# EAGLE design flippie (EAGLE 7.7.0)
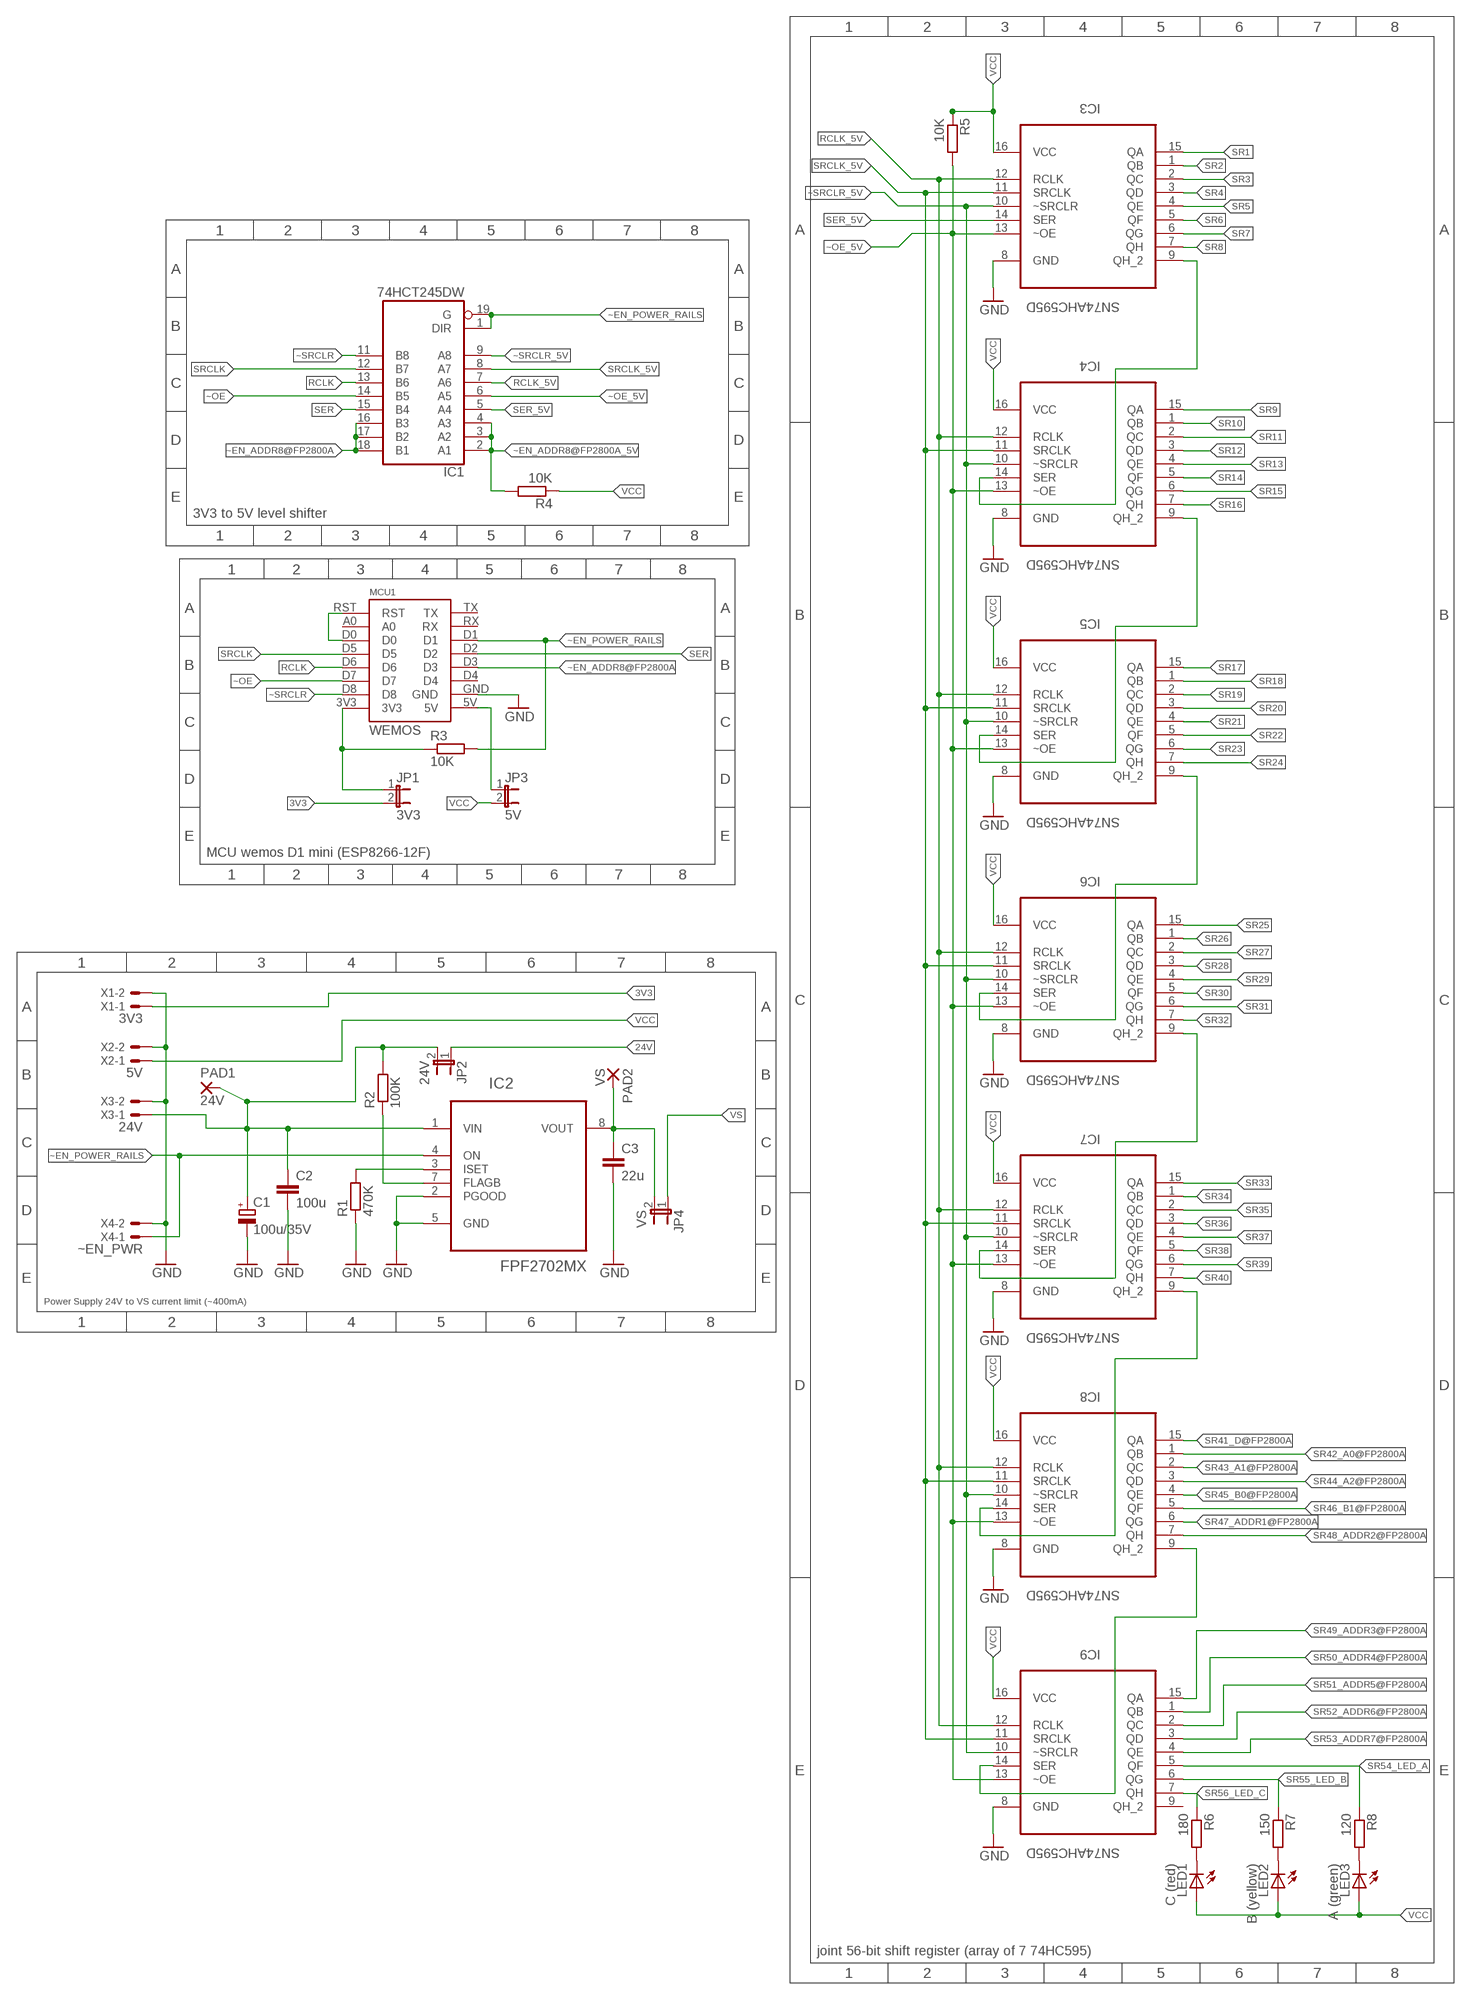
[diagram p0: schematic, sheet 1, part 1 of 2]
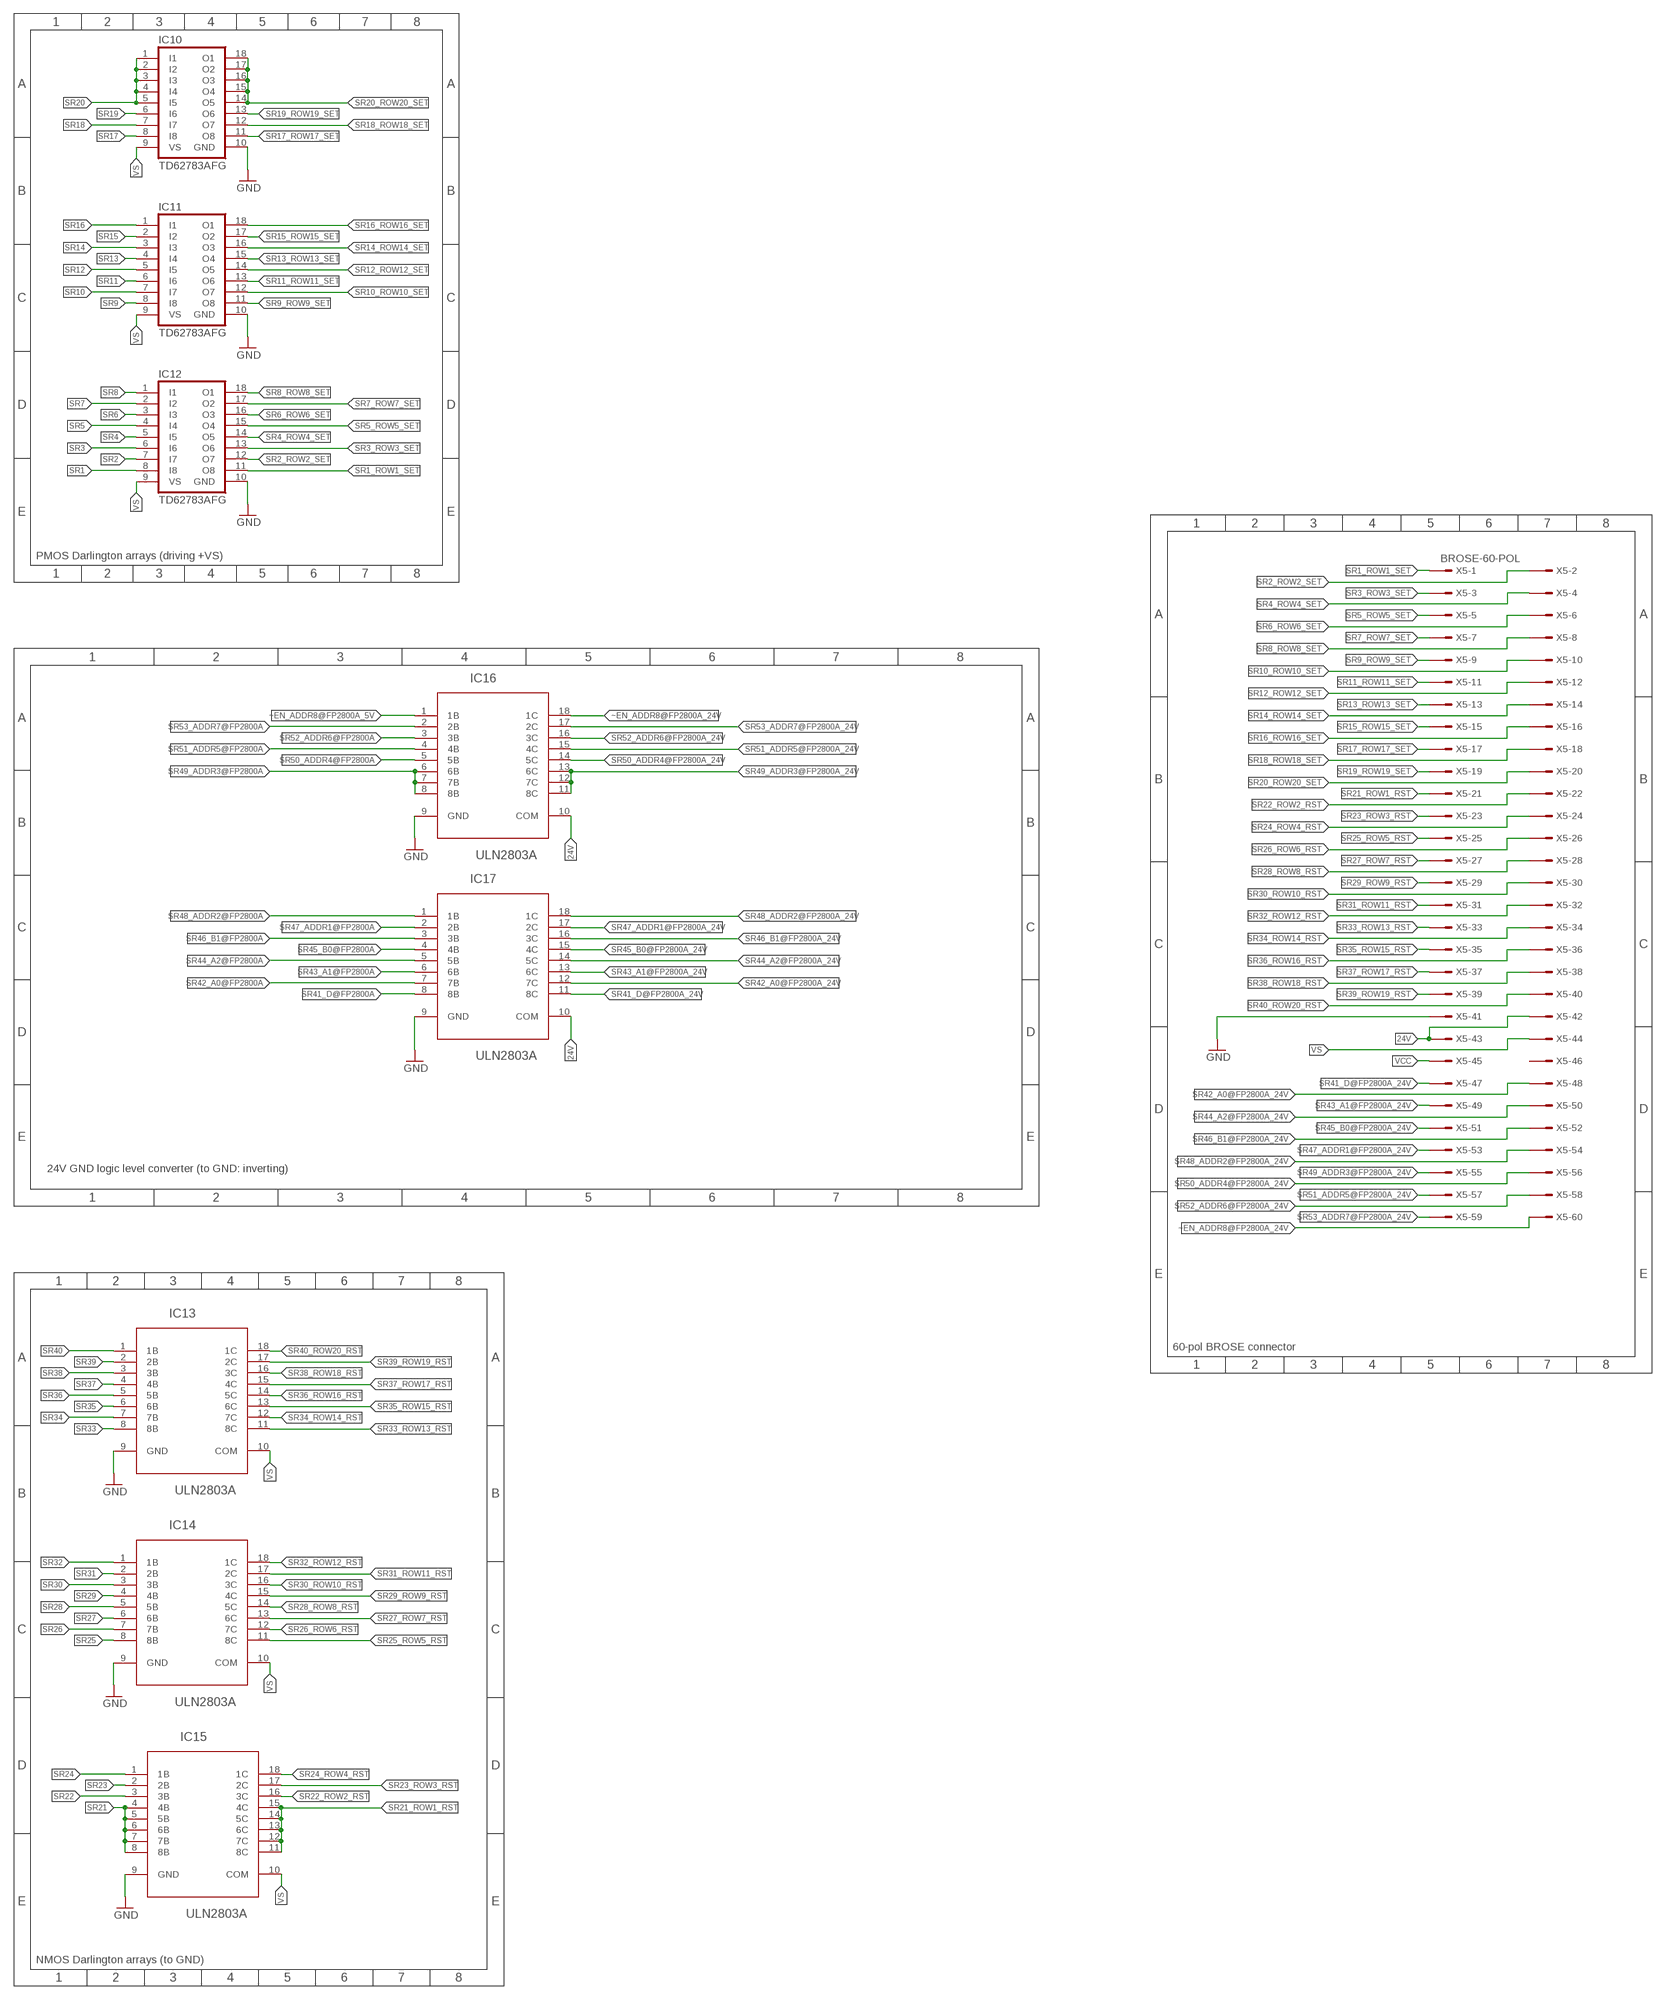
[diagram p1: schematic, sheet 1, part 2 of 2]

## Parts
C1  100u/35V  CPOL-EUE  [PANASONIC_E]
C2  100u  C-EUC1206  [C1206]
C3  22u  C-EUC1206  [C1206]
IC1  74HCT245DW  [SO20W]
IC2  FPF2702MX  FPF2700  [SOIC127P600X175-8N]
IC3  SN74AHC595D  [SOIC127P600X175-16N]
IC4  SN74AHC595D  [SOIC127P600X175-16N]
IC5  SN74AHC595D  [SOIC127P600X175-16N]
IC6  SN74AHC595D  [SOIC127P600X175-16N]
IC7  SN74AHC595D  [SOIC127P600X175-16N]
IC8  SN74AHC595D  [SOIC127P600X175-16N]
IC9  SN74AHC595D  [SOIC127P600X175-16N]
IC10  TD62783AFG  UDN2981LW  [SO18W]
IC11  TD62783AFG  UDN2981LW  [SO18W]
IC12  TD62783AFG  UDN2981LW  [SO18W]
IC13  ULN2803A  ULN2803ADW  [SOIC127P1030X265-18N]
IC14  ULN2803A  ULN2803ADW  [SOIC127P1030X265-18N]
IC15  ULN2803A  ULN2803ADW  [SOIC127P1030X265-18N]
IC16  ULN2803A  ULN2803ADW  [SOIC127P1030X265-18N]
IC17  ULN2803A  ULN2803ADW  [SOIC127P1030X265-18N]
JP1  3V3  JP1E  [JP1]
JP2  24V  JP1E  [JP1]
JP3  5V  JP1E  [JP1]
JP4  VS  JP1E  [JP1]
LED1  C (red)  LEDSMT1206  [1206]
LED2  B (yellow)  LEDSMT1206  [1206]
LED3  A (green)  LEDSMT1206  [1206]
MCU1  WEMOS  [WEMOS]
PAD1  24V  2,15/1,0  [2,15/1,0]
PAD2  VS  2,15/1,0  [2,15/1,0]
R1  470K  R-EU_R1206  [R1206]
R2  100K  R-EU_R1206  [R1206]
R3  10K  R-EU_R1206  [R1206]
R4  10K  R-EU_R1206  [R1206]
R5  10K  R-EU_R1206  [R1206]
R6  180  R-EU_R1206  [R1206]
R7  150  R-EU_R1206  [R1206]
R8  120  R-EU_R1206  [R1206]
X1  3V3  JST-XH-02-PIN-LONG-PAD  [JST-XH-02-PACKAGE-LONG-PAD]
X2  5V  JST-XH-02-PIN-LONG-PAD  [JST-XH-02-PACKAGE-LONG-PAD]
X3  24V  JST-XH-02-PIN-LONG-PAD  [JST-XH-02-PACKAGE-LONG-PAD]
X4  ~EN_PWR  JST-XH-02-PIN-LONG-PAD  [JST-XH-02-PACKAGE-LONG-PAD]
X5  BROSE-60-POL  057-060-1  [057-060-1]

## Nets
3V3: JP1.2 X1.1
3V3_SW: JP1.1 MCU1.3V3 R3.1
24V [24V]: IC16.10(COM) IC17.10(COM) JP2.1 X5.42 X5.43
24V_SW [24V]: C1.+ C2.1 IC2.1(VIN) JP2.2 PAD1.1(P) R2.2 X3.1
GND [24V]: C1.- C2.2 C3.2 IC2.2(PGOOD) IC2.5(GND) IC3.8(GND) IC4.8(GND) IC5.8(GND) IC6.8(GND) IC7.8(GND) IC8.8(GND) IC9.8(GND) IC10.10(GND) IC11.10(GND) IC12.10(GND) IC13.9(GND) IC14.9(GND) IC15.9(GND) IC16.9(GND) IC17.9(GND) MCU1.GND R1.1 X1.2 X2.2 X3.2 X4.2 X5.41
N$1: IC6.9(QH_2) IC7.14(SER)
N$3: IC2.7(FLAGB) R2.1
N$4: IC2.3(ISET) R1.2
N$5: LED1.C R6.2
N$7: IC8.9(QH_2) IC9.14(SER)
N$8: MCU1.D0 MCU1.RST
N$11: IC4.9(QH_2) IC5.14(SER)
N$21: LED2.C R7.2
N$22: IC5.9(QH_2) IC6.14(SER)
N$23: LED3.C R8.2
N$31: IC3.9(QH_2) IC4.14(SER)
N$37: IC7.9(QH_2) IC8.14(SER)
RCLK: IC1.13(B6) MCU1.D6
RCLK_5V: IC1.7(A6) IC3.12(RCLK) IC4.12(RCLK) IC5.12(RCLK) IC6.12(RCLK) IC7.12(RCLK) IC8.12(RCLK) IC9.12(RCLK)
SER: IC1.15(B4) MCU1.D2
SER_5V: IC1.5(A4) IC3.14(SER)
SR1: IC3.15(QA) IC12.8(I8)
SR1_ROW1_SET [24V]: IC12.11(O8) X5.1
SR2: IC3.1(QB) IC12.7(I7)
SR2_ROW2_SET [24V]: IC12.12(O7) X5.2
SR3: IC3.2(QC) IC12.6(I6)
SR3_ROW3_SET [24V]: IC12.13(O6) X5.3
SR4: IC3.3(QD) IC12.5(I5)
SR4_ROW4_SET [24V]: IC12.14(O5) X5.4
SR5: IC3.4(QE) IC12.4(I4)
SR5_ROW5_SET [24V]: IC12.15(O4) X5.5
SR6: IC3.5(QF) IC12.3(I3)
SR6_ROW6_SET [24V]: IC12.16(O3) X5.6
SR7: IC3.6(QG) IC12.2(I2)
SR7_ROW7_SET [24V]: IC12.17(O2) X5.7
SR8: IC3.7(QH) IC12.1(I1)
SR8_ROW8_SET [24V]: IC12.18(O1) X5.8
SR9: IC4.15(QA) IC11.8(I8)
SR9_ROW9_SET: IC11.11(O8) X5.9
SR10: IC4.1(QB) IC11.7(I7)
SR10_ROW10_SET: IC11.12(O7) X5.10
SR11: IC4.2(QC) IC11.6(I6)
SR11_ROW11_SET: IC11.13(O6) X5.11
SR12: IC4.3(QD) IC11.5(I5)
SR12_ROW12_SET: IC11.14(O5) X5.12
SR13: IC4.4(QE) IC11.4(I4)
SR13_ROW13_SET: IC11.15(O4) X5.13
SR14: IC4.5(QF) IC11.3(I3)
SR14_ROW14_SET: IC11.16(O3) X5.14
SR15: IC4.6(QG) IC11.2(I2)
SR15_ROW15_SET: IC11.17(O2) X5.15
SR16: IC4.7(QH) IC11.1(I1)
SR16_ROW16_SET: IC11.18(O1) X5.16
SR17: IC5.15(QA) IC10.8(I8)
SR17_ROW17_SET: IC10.11(O8) X5.17
SR18: IC5.1(QB) IC10.7(I7)
SR18_ROW18_SET: IC10.12(O7) X5.18
SR19: IC5.2(QC) IC10.6(I6)
SR19_ROW19_SET: IC10.13(O6) X5.19
SR20: IC5.3(QD) IC10.1(I1) IC10.2(I2) IC10.3(I3) IC10.4(I4) IC10.5(I5)
SR20_ROW20_SET: IC10.14(O5) IC10.15(O4) IC10.16(O3) IC10.17(O2) IC10.18(O1) X5.20
SR21: IC5.4(QE) IC15.4(4B) IC15.5(5B) IC15.6(6B) IC15.7(7B) IC15.8(8B)
SR21_ROW1_RST: IC15.11(8C) IC15.12(7C) IC15.13(6C) IC15.14(5C) IC15.15(4C) X5.21
SR22: IC5.5(QF) IC15.3(3B)
SR22_ROW2_RST: IC15.16(3C) X5.22
SR23: IC5.6(QG) IC15.2(2B)
SR23_ROW3_RST: IC15.17(2C) X5.23
SR24: IC5.7(QH) IC15.1(1B)
SR24_ROW4_RST: IC15.18(1C) X5.24
SR25: IC6.15(QA) IC14.8(8B)
SR25_ROW5_RST: IC14.11(8C) X5.25
SR26: IC6.1(QB) IC14.7(7B)
SR26_ROW6_RST: IC14.12(7C) X5.26
SR27: IC6.2(QC) IC14.6(6B)
SR27_ROW7_RST: IC14.13(6C) X5.27
SR28: IC6.3(QD) IC14.5(5B)
SR28_ROW8_RST: IC14.14(5C) X5.28
SR29: IC6.4(QE) IC14.4(4B)
SR29_ROW9_RST: IC14.15(4C) X5.29
SR30: IC6.5(QF) IC14.3(3B)
SR30_ROW10_RST: IC14.16(3C) X5.30
SR31: IC6.6(QG) IC14.2(2B)
SR31_ROW11_RST: IC14.17(2C) X5.31
SR32: IC6.7(QH) IC14.1(1B)
SR32_ROW12_RST: IC14.18(1C) X5.32
SR33: IC7.15(QA) IC13.8(8B)
SR33_ROW13_RST: IC13.11(8C) X5.33
SR34: IC7.1(QB) IC13.7(7B)
SR34_ROW14_RST: IC13.12(7C) X5.34
SR35: IC7.2(QC) IC13.6(6B)
SR35_ROW15_RST: IC13.13(6C) X5.35
SR36: IC7.3(QD) IC13.5(5B)
SR36_ROW16_RST: IC13.14(5C) X5.36
SR37: IC7.4(QE) IC13.4(4B)
SR37_ROW17_RST: IC13.15(4C) X5.37
SR38: IC7.5(QF) IC13.3(3B)
SR38_ROW18_RST: IC13.16(3C) X5.38
SR39: IC7.6(QG) IC13.2(2B)
SR39_ROW19_RST: IC13.17(2C) X5.39
SR40: IC7.7(QH) IC13.1(1B)
SR40_ROW20_RST: IC13.18(1C) X5.40
SR41_D@FP2800A: IC8.15(QA) IC17.8(8B)
SR41_D@FP2800A_24V: IC17.11(8C) X5.47
SR42_A0@FP2800A: IC8.1(QB) IC17.7(7B)
SR42_A0@FP2800A_24V: IC17.12(7C) X5.48
SR43_A1@FP2800A: IC8.2(QC) IC17.6(6B)
SR43_A1@FP2800A_24V: IC17.13(6C) X5.49
SR44_A2@FP2800A: IC8.3(QD) IC17.5(5B)
SR44_A2@FP2800A_24V: IC17.14(5C) X5.50
SR45_B0@FP2800A: IC8.4(QE) IC17.4(4B)
SR45_B0@FP2800A_24V: IC17.15(4C) X5.51
SR46_B1@FP2800A: IC8.5(QF) IC17.3(3B)
SR46_B1@FP2800A_24V: IC17.16(3C) X5.52
SR47_ADDR1@FP2800A: IC8.6(QG) IC17.2(2B)
SR47_ADDR1@FP2800A_24V: IC17.17(2C) X5.53
SR48_ADDR2@FP2800A: IC8.7(QH) IC17.1(1B)
SR48_ADDR2@FP2800A_24V: IC17.18(1C) X5.54
SR49_ADDR3@FP2800A: IC9.15(QA) IC16.6(6B) IC16.7(7B) IC16.8(8B)
SR49_ADDR3@FP2800A_24V: IC16.11(8C) IC16.12(7C) IC16.13(6C) X5.55
SR50_ADDR4@FP2800A: IC9.1(QB) IC16.5(5B)
SR50_ADDR4@FP2800A_24V: IC16.14(5C) X5.56
SR51_ADDR5@FP2800A: IC9.2(QC) IC16.4(4B)
SR51_ADDR5@FP2800A_24V: IC16.15(4C) X5.57
SR52_ADDR6@FP2800A: IC9.3(QD) IC16.3(3B)
SR52_ADDR6@FP2800A_24V: IC16.16(3C) X5.58
SR53_ADDR7@FP2800A: IC9.4(QE) IC16.2(2B)
SR53_ADDR7@FP2800A_24V: IC16.17(2C) X5.59
SR54_LED_A: IC9.5(QF) R8.1
SR55_LED_B: IC9.6(QG) R7.1
SR56_LED_C: IC9.7(QH) R6.1
SRCLK: IC1.12(B7) MCU1.D5
SRCLK_5V: IC1.8(A7) IC3.11(SRCLK) IC4.11(SRCLK) IC5.11(SRCLK) IC6.11(SRCLK) IC7.11(SRCLK) IC8.11(SRCLK) IC9.11(SRCLK)
VCC [5V]: IC3.16(VCC) IC4.16(VCC) IC5.16(VCC) IC6.16(VCC) IC7.16(VCC) IC8.16(VCC) IC9.16(VCC) JP3.2 LED1.A LED2.A LED3.A R4.1 R5.1 X2.1 X5.45
VCC_SW: JP3.1 MCU1.5V
VS [24V]: IC10.9(VS) IC11.9(VS) IC12.9(VS) IC13.10(COM) IC14.10(COM) IC15.10(COM) JP4.1 X5.44
VS_SW [24V]: C3.1 IC2.8(VOUT) JP4.2 PAD2.1(P)
~EN_ADDR8@FP2800A: IC1.16(B3) IC1.17(B2) IC1.18(B1) MCU1.D3
~EN_ADDR8@FP2800A_5V: IC1.2(A1) IC1.3(A2) IC1.4(A3) IC16.1(1B) R4.2
~EN_ADDR8@FP2800A_24V: IC16.18(1C) X5.60
~EN_POWER_RAILS: IC1.1(DIR) IC1.19(G) IC2.4(ON) MCU1.D1 R3.2 X4.1
~OE: IC1.14(B5) MCU1.D7
~OE_5V: IC1.6(A5) IC3.13(~OE) IC4.13(~OE) IC5.13(~OE) IC6.13(~OE) IC7.13(~OE) IC8.13(~OE) IC9.13(~OE) R5.2
~SRCLR: IC1.11(B8) MCU1.D8
~SRCLR_5V: IC1.9(A8) IC3.10(~SRCLR) IC4.10(~SRCLR) IC5.10(~SRCLR) IC6.10(~SRCLR) IC7.10(~SRCLR) IC8.10(~SRCLR) IC9.10(~SRCLR)
Unconnected: IC9.9(QH_2) MCU1.A0 MCU1.D4 MCU1.RX MCU1.TX X5.46

## Notes on the sheet
- PMOS Darlington arrays (driving +VS)
- 3V3 to 5V level shifter
- MCU wemos D1 mini (ESP8266-12F)
- 24V GND logic level converter (to GND: inverting)
- Power Supply 24V to VS current limit (~400mA)
- 60-pol BROSE connector
- joint 56-bit shift register (array of 7 74HC595)
- NMOS Darlington arrays (to GND)

## Power pins joined to a net without a drawn wire
GND: IC1.10(GND)
VCC: IC1.20(VCC)

## Library data of the parts
C1 = rcl:CPOL-EU: POLARIZED CAPACITOR, European symbol
C2 C3 = rcl:C-EU: CAPACITOR, European symbol
IC1 = 74xx-eu:74*245: Octal BUS TRANSCEIVER, 3-state
IC2 = ON Semiconductor_By_element14_Batch_1:FPF2700: AccuPower 0.4~2 A Adjustable Over-Current Protection Load Switch; PACKAGE: SOIC-8; SUPPLIER: ON Semiconductor
IC3-IC9 = Texas Instruments_By_element14_Batch_1:SN74AHC595D: 8 bit Shift registers; MPN: SN74AHC595D; OC_FARNELL: 1750222; OC_NEWARK: 50R5928; PACKAGE: SOIC-16; SUPPLIER: Texas Instruments
IC10-IC12 = uln-udn:UDN298*: DRIVER ARRAY Source: Allegro Microsystems Inc. / UDN2981-UDN2984.pdf
IC13-IC17 = Texas Instruments_By_element14_Batch_1:ULN2803ADW: Darlington transistor array; MPN: ULN2803ADW; OC_FARNELL: 1652419; OC_NEWARK: 69K0711; PACKAGE: SOIC-18; SUPPLIER: TEXAS INSTRUMENTS
JP1-JP4 = jumper:JP1E: JUMPER
LED1-LED3 = adafruit:LED: LED OSRAM: - CHIPLED LG R971, LG N971, LY N971, LG Q971, LY Q971, LO R971, LY R971 LH N974, LH R974 LS Q976, LO Q976, LY Q976 LO Q996 - Hyper CHIPLED LW Q18S LB Q993, LB Q99A, LB R99A - SideLED LS A670, LO A670, LY A670, LG A670, LP A670 LB A673, LV A673, LT A673, LW A673 LH A674 LY A675 LS A676, LA A676, LO A676, LY A676, LW A676 LS A679, LY A679, LG A679 - Hyper Micro SIDELED® LS Y876, LA Y876, LO Y876, LY Y876 LT Y87S - SmartLED LW L88C, LW L88S LB L89C, LB L89S, LG L890 LS L89K, LO L89K, LY L89K LS L896, LA L896, LO L896, LY L896 - TOPLED LS T670, LO T670, LY T670, LG T670, LP T670 LSG T670, LSP T670, LSY T670, LOP T670, LYG T670 LG T671, LOG T671, LSG T671 LB T673, LV T673, LT T673, LW T673 LH T674 LS T676, LA T676, LO T676, LY T676, LB T676, LH T676, LSB T676, LW T676 LB T67C, LV T67C, LT T67C, LS T67K, LO T67K, LY T67K, LW E67C LS E67B, LA E67B, LO E67B, LY E67B, LB E67C, LV E67C, LT E67C LW T67C LS T679, LY T679, LG T679 LS T770, LO T770, LY T770, LG T770, LP T770 LB T773, LV T773, LT T773, LW T773 LH T774 LS E675, LA E675, LY E675, LS T675 LS T776, LA T776, LO T776, LY T776, LB T776 LHGB T686 LT T68C, LB T68C - Hyper Mini TOPLED® LB M676 - Mini TOPLED Santana® LG M470 LS M47K, LO M47K, LY M47K Source: http://www.osram.convergy.de/
MCU1 = wemos:WEMOS
PAD1 PAD2 = wirepad:2,15/1,0: THROUGH-HOLE PAD
R1-R8 = rcl:R-EU_: RESISTOR, European symbol
X1-X4 = Rembrandt Electronics - JST XH Connectors v1-0:JST-XH-02-PIN: JST XH Connector 2 Pin Wire to board connector. Pitch: 2,54 mm, (0.100") Number of pins: 2 Created by Rembrandt Electronics www.rembrandtelectronics.com
X5 = con-panduit:057-060-: CONNECTOR 60-pin series 057 contact pc board low profile headers; OC_FARNELL: unknown; OC_NEWARK: unknown

## Net classes
0 default: width 0.152 mm, drill 0.152 mm, clearance 0.152 mm
1 24V: width 0.305 mm, drill 0.254 mm, clearance 0.152 mm
2 5V: width 0.254 mm, drill 0.203 mm, clearance 0.152 mm
3 3V3: width 0.152 mm, drill 0.152 mm, clearance 0.152 mm

## Board
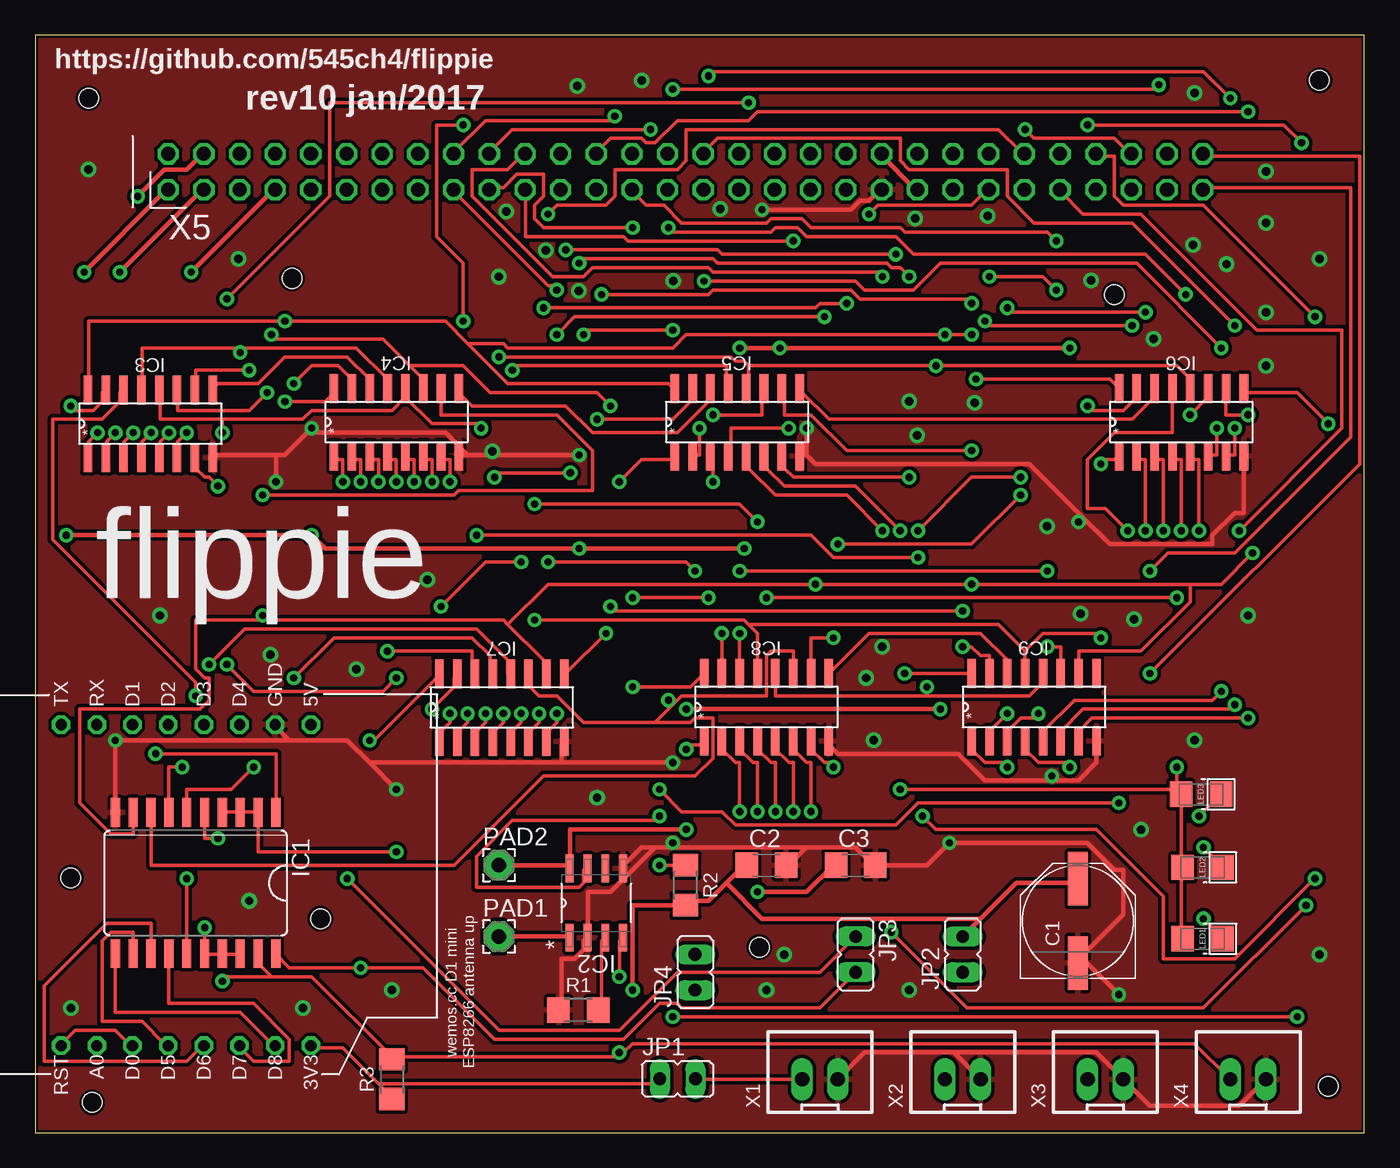
[diagram p2: board, top side]
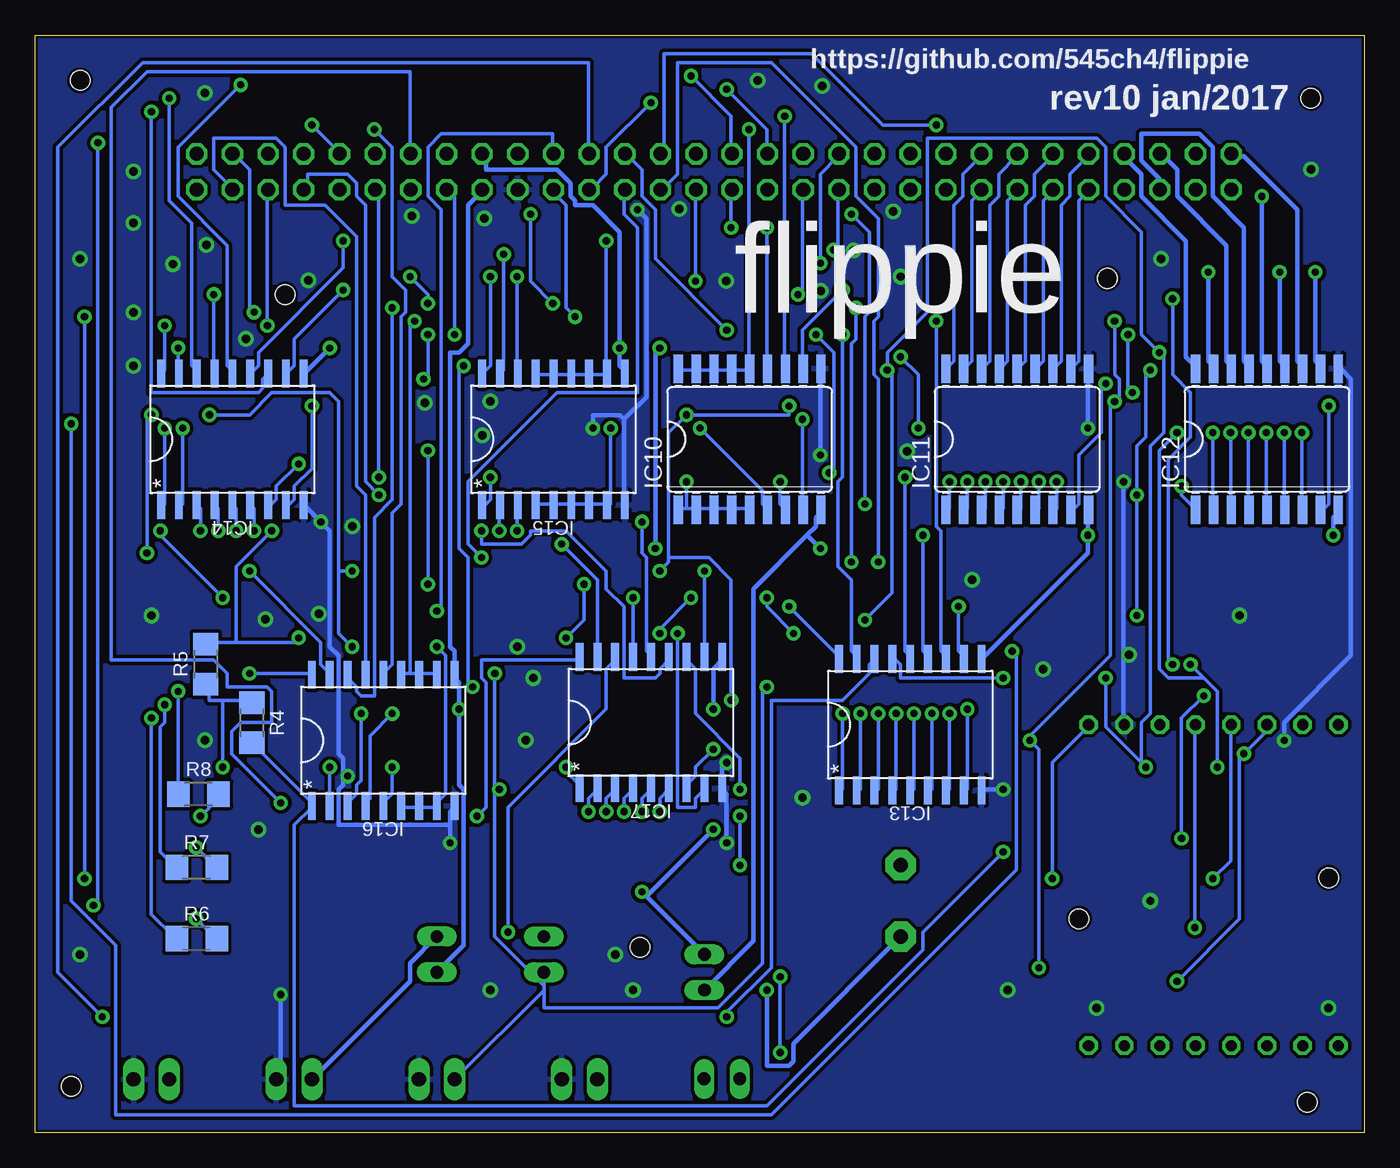
[diagram p3: board, bottom side, seen from below]

Size 94.64 x 78.16 mm. Coordinates in mm from the lower left corner, seen from the top.
Outline: 0,0 94.64,0 94.64,78.16 0,78.16 0,0
Copper layers (1*16): Top 0.035mm / dielectric 1.5mm / Bottom 0.035mm
Design rules "SparkFun-2-layer-STANDARD *": minimum track width 10mil, minimum drill 20mil, track to track 10mil, track to pad 8mil, pad to pad 8mil, via to via 10mil, smd to smd 8mil, copper to edge 8mil, drill to drill 8mil, minimum pad ring 10mil, minimum via ring 10mil, stop-mask expansion 4mil, vias tented up to drill 25mil, thermal gap 10mil
Holes 1.4 mm at 3.81,73.66 91.44,74.93 92.08,3.3 4.06,2.16 2.54,18.16 20.32,15.24 18.29,60.83 76.83,59.69 51.56,13.21

### Footprints (pad centres in the part's own frame; a part is rotated, then mirrored left to right if it is on the bottom)
PANASONIC_E = smd 3.8 x 1.4: + 3,0; - -3,0
C1206 = smd 1.6 x 1.8: 1 -1.4,0; 2 1.4,0
SO20W = smd 0.66 x 2.032: 1 -5.715,-5.029; 2 -4.445,-5.029; 3 -3.175,-5.029; 4 -1.905,-5.029; 5 -0.635,-5.029; 6 0.635,-5.029; 7 1.905,-5.029; 8 3.175,-5.029; 9 4.445,-5.029; 10 5.715,-5.029; 11 5.715,5.029; 12 4.445,5.029; 13 3.175,5.029; 14 1.905,5.029; 15 0.635,5.029; 16 -0.635,5.029; 17 -1.905,5.029; 18 -3.175,5.029; 19 -4.445,5.029; 20 -5.715,5.029
SOIC127P600X175-8N = smd 1.981 x 0.559: 1 -2.464,1.905; 2 -2.464,0.635; 3 -2.464,-0.635; 4 -2.464,-1.905; 5 2.464,-1.905; 6 2.464,-0.635; 7 2.464,0.635; 8 2.464,1.905
SOIC127P600X175-16N = smd 2.057 x 0.61: 1 -2.578,4.445; 2 -2.578,3.175; 3 -2.578,1.905; 4 -2.578,0.635; 5 -2.578,-0.635; 6 -2.578,-1.905; 7 -2.578,-3.175; 8 -2.578,-4.445; 9 2.223,-4.445; 10 2.223,-3.175; 11 2.223,-1.905; 12 2.223,-0.635; 13 2.223,0.635; 14 2.223,1.905; 15 2.223,3.175; 16 2.223,4.445
SO18W = smd 0.66 x 2.032: 1 -5.08,-5.029; 2 -3.81,-5.029; 3 -2.54,-5.029; 4 -1.27,-5.029; 5 0,-5.029; 6 1.27,-5.029; 7 2.54,-5.029; 8 3.81,-5.029; 9 5.08,-5.029; 10 5.08,5.029; 11 3.81,5.029; 12 2.54,5.029; 13 1.27,5.029; 14 0,5.029; 15 -1.27,5.029; 16 -2.54,5.029; 17 -3.81,5.029; 18 -5.08,5.029
SOIC127P1030X265-18N = smd 1.981 x 0.559: 1 -4.674,5.08; 2 -4.674,3.81; 3 -4.674,2.54; 4 -4.674,1.27; 5 -4.674,0; 6 -4.674,-1.27; 7 -4.674,-2.54; 8 -4.674,-3.81; 9 -4.674,-5.08; 10 4.674,-5.08; 11 4.674,-3.81; 12 4.674,-2.54; 13 4.674,-1.27; 14 4.674,0; 15 4.674,1.27; 16 4.674,2.54; 17 4.674,3.81; 18 4.674,5.08
JP1 = drill 0.914 long: 1 0,-1.27; 2 0,1.27
1206 = smd 1.6 x 1.803: A -1.422,0; C 1.422,0
WEMOS = drill 0.8 octagon: 3V3 0,0; 5V 22.86,0; A0 0,15.24; D0 0,12.7; D1 22.86,12.7; D2 22.86,10.16; D3 22.86,7.62; D4 22.86,5.08; D5 0,10.16; D6 0,7.62; D7 0,5.08; D8 0,2.54; GND 22.86,2.54; RST 0,17.78; RX 22.86,15.24; TX 22.86,17.78
2,15/1,0 = drill 1.016 pad 2.159 octagon: 1 0,0
R1206 = smd 1.6 x 1.803: 1 -1.422,0; 2 1.422,0
JST-XH-02-PACKAGE-LONG-PAD = drill 1.016 long: 1 -1.27,0; 2 1.27,0
057-060-1 = drill 1 octagon: 1 -36.83,-1.27; 2 -36.83,1.27; 3 -34.29,-1.27; 4 -34.29,1.27; 5 -31.75,-1.27; 6 -31.75,1.27; 7 -29.21,-1.27; 8 -29.21,1.27; 9 -26.67,-1.27; 10 -26.67,1.27; 11 -24.13,-1.27; 12 -24.13,1.27; 13 -21.59,-1.27; 14 -21.59,1.27; 15 -19.05,-1.27; 16 -19.05,1.27; 17 -16.51,-1.27; 18 -16.51,1.27; 19 -13.97,-1.27; 20 -13.97,1.27; 21 -11.43,-1.27; 22 -11.43,1.27; 23 -8.89,-1.27; 24 -8.89,1.27; 25 -6.35,-1.27; 26 -6.35,1.27; 27 -3.81,-1.27; 28 -3.81,1.27; 29 -1.27,-1.27; 30 -1.27,1.27; 31 1.27,-1.27; 32 1.27,1.27; 33 3.81,-1.27; 34 3.81,1.27; 35 6.35,-1.27; 36 6.35,1.27; 37 8.89,-1.27; 38 8.89,1.27; 39 11.43,-1.27; 40 11.43,1.27; 41 13.97,-1.27; 42 13.97,1.27; 43 16.51,-1.27; 44 16.51,1.27; 45 19.05,-1.27; 46 19.05,1.27; 47 21.59,-1.27; 48 21.59,1.27; 49 24.13,-1.27; 50 24.13,1.27; 51 26.67,-1.27; 52 26.67,1.27; 53 29.21,-1.27; 54 29.21,1.27; 55 31.75,-1.27; 56 31.75,1.27; 57 34.29,-1.27; 58 34.29,1.27; 59 36.83,-1.27; 60 36.83,1.27

### Placement (x,y rotation side)
C1  74.24,15.09 90 top
C2  52.07,19.05 0 top
C3  58.42,19.05 0 top
IC1  11.43,17.78 180 top
IC2  39.95,16.36 90 top
IC3  8.2,50.65 90 top
IC4  25.73,50.77 90 top
IC5  49.99,50.77 90 top
IC6  81.61,50.77 90 top
IC7  33.22,30.45 90 top
IC8  52.07,30.48 90 top
IC9  71.12,30.48 90 top
IC10  43.76,49.38 0 bottom
IC11  24.71,49.38 0 bottom
IC12  6.93,49.38 0 bottom
IC13  32.33,29.06 90 bottom
IC14  80.59,49.38 90 bottom
IC15  57.73,49.38 90 bottom
IC16  69.85,27.94 90 bottom
IC17  50.8,29.21 90 bottom
JP1  45.75,3.84 270 top
JP2  66.04,12.7 0 top
JP3  58.42,12.7 180 top
JP4  46.99,11.43 0 top
LED1  83.13,13.82 0 top
LED2  83.13,18.9 0 top
LED3  83.01,24.1 0 top
MCU1  19.63,6.2 90 top
PAD1  33.02,13.97 0 top
PAD2  33.02,19.05 0 top
R1  38.68,8.74 0 top
R2  46.3,17.63 270 top
R3  25.4,3.81 90 top
R4  79.2,29.18 270 bottom
R5  82.5,33.38 90 bottom
R6  83.13,13.82 0 bottom
R7  83.13,18.9 0 bottom
R8  83.01,24.1 0 bottom
X1  55.88,3.81 0 top
X2  66.04,3.81 0 top
X3  76.2,3.81 0 top
X4  86.36,3.81 0 top
X5  46.3,68.43 0 top

### Tracks (layer width: path | path; a pad name or v marks a point on that pad's centre or on a via)
3V3
  Top 0.254: X1.1 47.31,3.81 JP1.2
3V3_SW
  Top 0.254: 24.45,3.49 21.91,6.03 19.68,6.03 MCU1.3V3 | 24.45,3.49 25.4,2.54 R3.1 | JP1.1 44.13,3.49 24.45,3.49
24V  (via drill 0.51)
  Top 0.305: X5.43 62.55,67.31 60.33,69.53 X5.42 | v64.45,30.16 v46.35,30.16
  Bottom 0.305: JP2.1 64.14,13.34 64.14,24.45 64.45,24.77 v64.45,30.16 64.45,32.07 64.77,32.38 IC16.10 64.77,34.29 65.09,34.61 65.09,55.56 64.45,55.56 63.82,56.2 63.82,66.04 62.87,66.99 X5.43 | v46.35,30.16 46.35,33.02 45.72,33.66 IC17.10
24V_SW  (via drill 0.51)
  Top 0.305: PAD1.1 37.78,13.97 IC2.1 | 49.21,17.78 47.94,16.51 46.35,16.51 R2.2 46.04,16.19 42.55,16.19 v42.55,10.16 | 49.21,17.78 50.48,19.05 C2.1 | 67.31,15.24 69.85,17.78 73.98,17.78 C1.+ | 67.31,15.24 JP2.2 | 49.21,17.78 51.75,15.24 67.31,15.24
  Bottom 0.305: X3.1 67.94,10.79 67.94,12.06 JP2.2 | PAD1.1 40.64,6.35 40.64,5.08 40.96,4.76 42.55,4.76 v42.55,10.16
GND  (via drill 0.51, 0.6)
  Top 0.305: 17.14,48.26 12.7,48.26 IC3.8 | 17.14,48.26 17.78,48.26 v19.68,50.16 20,49.85 29.21,49.85 30.8,48.26 | 30.8,48.26 30.16,48.26 IC4.8 | 30.8,48.26 v38.73,48.26 | 23.81,26.35 22.23,27.94 18.1,27.94 | 23.81,26.35 v25.72,24.45 | 18.1,27.94 17.14,28.89 MCU1.GND | IC1.10 v5.71,27.94 18.1,27.94 | 37.47,26.35 37.47,27.62 IC7.8 | 23.81,26.35 37.47,26.35 | v17.14,46.35 17.14,48.26 | 54.93,48.26 v54.93,50.16 | 54.93,48.26 54.61,48.26 IC5.8 | 74.61,43.81 70.8,47.62 55.56,47.62 54.93,48.26 | 74.61,43.81 76.52,41.91 83.82,41.91 83.82,42.55 85.41,44.13 86.04,44.13 86.04,47.94 IC6.8 | v51.75,65.72 58.1,65.72 58.74,66.36 59.37,66.36 60.01,66.99 X5.41 | X1.2 59.05,5.71 65.41,5.71 | X2.2 65.41,5.71 | 65.41,5.71 75.56,5.71 X3.2 79.38,1.91 85.72,1.91 X4.2 | 72.39,25.08 74.3,25.08 75.56,26.35 IC9.8 | 72.39,25.08 67.63,25.08 65.72,26.99 57.15,26.99 56.52,27.62 IC8.8 | R1.1 37.47,8.89 37.47,12.38 38.42,12.38 39.05,13.02 39.05,13.65 IC2.2 39.37,13.97 39.37,17.14 40.96,17.14 44.13,20.32 | 54.93,20.32 53.66,19.05 C2.2 | 54.93,20.32 58.42,20.32 59.69,19.05 C3.2 63.5,19.05 v65.09,20.64 74.93,20.64 76.83,18.73 77.47,18.73 77.47,15.56 74.3,12.38 C1.- 74.3,12.06 74.93,12.06 v77.15,9.84 | 54.93,20.32 45.4,20.32 | 45.4,20.32 44.13,20.32 | 44.13,20.32 43.18,20.32 41.91,19.05 IC2.5 | 45.4,20.32 v45.4,20.64 | v72.39,25.4 72.39,25.08 | v74.3,43.5 74.61,43.81 | v45.4,26.35 37.47,26.35
  Bottom 0.305: v19.68,50.16 19.68,54.29 IC11.10 | v38.73,48.26 38.73,54.29 IC10.10 | v25.72,24.45 26.99,24.45 IC13.9 | v5.71,27.94 5.71,29.21 0.95,33.97 0.95,53.66 1.59,54.29 IC12.10 | v17.14,46.35 17.14,29.21 MCU1.GND | 52.7,50.8 52.7,44.77 IC15.9 | 52.7,50.8 53.02,51.12 54.93,51.12 v54.93,50.16 | v51.75,65.72 51.12,65.09 51.12,52.39 52.7,50.8 | v45.4,20.64 45.4,24.13 45.72,24.45 IC17.9 45.72,26.04 v45.4,26.35 | v65.09,20.64 65.09,21.91 | 65.09,21.91 65.09,22.86 64.77,23.18 IC16.9 | 72.71,25.4 72.71,24.77 73.03,24.45 73.03,21.91 65.09,21.91 | 72.71,25.4 72.71,26.67 73.03,26.99 73.03,33.97 73.66,34.61 73.66,42.86 v74.3,43.5 75.25,44.45 IC14.9 | 72.71,25.4 v72.39,25.4 | X3.2 77.15,4.13 v77.15,9.84
  other vias: 3.81,68.58 8.89,36.83 27.94,39.37 22.86,33.02 59.69,27.94 15.24,16.51 25.4,10.16 19.05,8.89 2.54,8.89 86.36,36.83 53.34,12.7 52.07,10.16 62.23,10.16 78.74,21.59 87.63,58.42 87.63,64.77 91.44,62.23 87.63,54.61 38.61,74.55 43.18,74.93 33.02,60.96 82.55,74.04 91.44,12.7 84.84,61.85 40.01,23.88 16.76,34.04 59.18,32.38 74.42,36.96 79.63,56.52 78.23,36.58 87.63,68.45 48.77,65.79 72.06,43.18 62.66,65.1 67.82,65.28 75.18,60.71 14.48,62.23 82.55,27.94 62.81,49.66 62.23,52.07 66.88,51.97 60.3,34.59 32.54,48.51 45.44,60.66 38.71,59.94 33.55,65.61 36.35,62.81 82.45,63.22
  pour Top: -1.27,80.01 96.52,80.01 96.52,-1.27 -1.27,-1.27
  pour Bottom: -1.27,80.01 96.52,80.01 96.52,-1.27 -1.27,-1.27
N$1  (via drill 0.51)
  Top 0.254: v25.08,34.29 31.11,34.29 31.11,32.7 IC7.14 | v92.08,50.48 89.85,52.7 86.04,52.7 IC6.9
  Bottom 0.254: v25.08,34.29 24.77,33.97 24.77,18.73 42.23,1.27 88.9,1.27 88.9,13.34 92.08,16.51 v92.08,50.48
N$3  (via drill 0.51)
  Top 0.254: v44.45,19.05 46.04,19.05 R2.1 | v44.45,22.54 44.13,22.23 33.97,22.23 31.43,19.68 31.43,17.46 38.73,17.46 39.05,17.78 39.05,18.73 IC2.7
  Bottom 0.254: v44.45,22.54 v44.45,19.05
N$4
  Top 0.254: R1.2 40.32,8.89 40.32,13.65 IC2.3
N$5  (via drill 0.51)
  Top 0.254: v83.19,15.24 84.45,13.97 LED1.C
  Bottom 0.254: v83.19,15.24 81.92,13.97 R6.2
N$7
  Top 0.254: IC8.9 59.37,35.56 67.31,35.56 69.22,33.66 IC9.14
N$8
  Top 0.254: MCU1.RST 1.91,6.35 2.86,7.3 5.71,7.3 6.67,6.35 MCU1.D0
N$11
  Top 0.254: IC4.9 30.16,52.7 31.11,51.75 37.78,51.75 39.69,49.85 45.72,49.85 47.94,52.07 47.94,52.7 IC5.14
N$21  (via drill 0.51)
  Top 0.254: v83.19,20.32 84.45,19.05 LED2.C
  Bottom 0.254: v83.19,20.32 81.92,19.05 R7.2
N$22
  Top 0.254: IC5.9 54.61,52.7 56.52,50.8 78.11,50.8 79.69,52.39 79.69,52.7 IC6.14
N$23  (via drill 0.51)
  Top 0.254: v82.87,22.54 84.14,23.81 LED3.C
  Bottom 0.254: v82.87,22.54 81.6,23.81 R8.2
N$31
  Top 0.254: IC3.9 12.7,53.02 13.02,53.34 15.88,53.34 17.78,55.24 22.23,55.24 23.81,53.66 23.81,53.02 IC4.14
N$37  (via drill 0.51)
  Top 0.254: v40.64,35.56 37.78,32.7 IC7.9 | v47.94,38.1 v42.55,38.1 | IC8.14 v50.16,35.56
  Bottom 0.254: v40.64,35.56 42.55,37.47 v42.55,38.1 | v47.94,38.1 50.16,35.88 v50.16,35.56
RCLK
  Top 0.254: IC1.13 8.26,14.92 5.08,14.92 0.64,10.48 0.64,5.08 10.79,5.08 11.75,6.03 MCU1.D6
RCLK_5V  (via drill 0.51)
  Top 0.254: IC8.12 52.7,31.11 63.5,31.11 | 63.5,31.11 70.8,31.11 71.75,32.07 IC9.12 | 50.8,54.61 50.8,53.02 IC5.12 | 50.8,54.61 v64.14,54.61 81.28,54.61 82.23,53.66 82.23,53.02 IC6.12 | v63.5,31.75 63.5,31.11 | 13.34,50.8 19.05,50.8 19.68,51.44 25.4,51.44 26.35,52.39 | 13.34,50.8 8.89,50.8 8.89,52.7 IC3.12 | 26.35,52.39 26.35,52.7 IC4.12 26.35,52.39 | IC1.7 9.53,26.04 v10.48,26.04 | v12.38,33.34 14.92,35.88 31.43,35.88 33.66,33.66 33.66,32.7 IC7.12 | v13.34,49.85 13.34,50.8 | 50.8,54.61 50.48,54.93 49.85,54.93 49.53,55.24 v33.02,55.24 | v31.75,50.16 31.43,50.48 28.26,50.48 26.35,52.39
  Bottom 0.254: v63.5,31.75 63.82,32.07 63.82,40.96 64.45,41.59 64.45,54.29 v64.14,54.61 | v10.48,26.04 10.48,31.43 11.43,32.38 | v12.38,33.34 11.43,32.38 | v13.34,49.85 14.61,48.58 14.61,33.02 13.97,32.38 11.43,32.38 | v33.02,55.24 31.75,53.98 v31.75,50.16
SER  (via drill 0.51)
  Top 0.254: v10.79,18.1 IC1.15
  Bottom 0.254: v10.79,18.1 9.53,19.37 9.53,28.89 MCU1.D2
SER_5V  (via drill 0.51)
  Top 0.254: IC1.5 12.06,20.95 v13.02,20.95 | v11.43,31.11 11.43,32.07 1.27,42.23 1.27,50.8 4.76,50.8 6.03,52.07 6.03,52.7 IC3.14
  Bottom 0.254: v13.02,20.95 13.02,29.53 v11.43,31.11
SR1  (via drill 0.51)
  Top 0.254: v2.54,51.75 2.86,51.44 4.13,51.44 4.76,52.07 4.76,52.7 IC3.15
  Bottom 0.254: v2.54,51.75 2.54,44.77 2.86,44.45 IC12.8
SR1_ROW1_SET  (via drill 0.51)
  Top 0.305: v3.49,61.28 9.21,66.99 X5.1
  Bottom 0.305: v3.49,61.28 3.49,54.93 3.17,54.61 IC12.11
SR2  (via drill 0.51)
  Top 0.254: v4.45,49.85 3.81,49.21 3.81,48.26 IC3.1
  Bottom 0.254: v4.45,49.85 4.45,44.45 IC12.7
SR2_ROW2_SET
  Bottom 0.305: IC12.12 4.45,54.61 4.76,54.93 4.76,65.72 8.57,69.53 9.21,69.53 X5.2
SR3  (via drill 0.51)
  Top 0.254: v5.71,49.85 5.08,49.21 5.08,48.26 IC3.2
  Bottom 0.254: v5.71,49.85 5.71,44.45 IC12.6
SR3_ROW3_SET  (via drill 0.51)
  Top 0.305: v6.03,61.28 11.75,66.99 X5.3
  Bottom 0.305: v6.03,61.28 6.03,54.93 5.71,54.61 IC12.13
SR4  (via drill 0.51)
  Top 0.254: v6.99,49.85 6.35,49.21 6.35,48.26 IC3.3
  Bottom 0.254: v6.99,49.85 6.99,44.45 IC12.5
SR4_ROW4_SET  (via drill 0.51)
  Top 0.305: v7.3,66.67 9.21,68.58 10.79,68.58 11.75,69.53 X5.4
  Bottom 0.305: v7.3,66.67 7.3,54.93 6.99,54.61 IC12.14
SR5  (via drill 0.51)
  Top 0.254: v8.26,49.85 7.62,49.21 7.62,48.26 IC3.4
  Bottom 0.254: v8.26,49.85 8.26,44.45 IC12.4
SR5_ROW5_SET
  Bottom 0.305: IC12.15 8.26,54.61 8.57,54.93 8.57,64.45 10.79,66.67 10.79,70.17 11.75,71.12 15.88,71.12 15.88,69.22 14.61,67.94 14.61,67.31 X5.5
SR6  (via drill 0.51)
  Top 0.254: v9.53,49.85 8.89,49.21 8.89,48.26 IC3.5
  Bottom 0.254: v9.53,49.85 9.53,44.45 IC12.3
SR6_ROW6_SET
  Bottom 0.305: IC12.16 9.53,54.61 9.84,54.93 9.84,63.18 13.34,66.67 13.34,68.58 14.29,69.53 X5.6
SR7  (via drill 0.51)
  Top 0.254: v10.79,49.85 10.16,49.21 10.16,48.26 IC3.6
  Bottom 0.254: v10.79,49.85 10.79,44.45 IC12.2
SR7_ROW7_SET  (via drill 0.51)
  Top 0.305: v11.11,61.28 16.83,66.99 X5.7
  Bottom 0.305: v11.11,61.28 11.11,54.93 10.79,54.61 IC12.17
SR8  (via drill 0.51)
  Top 0.254: v13.02,46.04 12.38,46.67 12.06,46.67 11.43,47.31 11.43,47.94 IC3.7
  Bottom 0.254: v13.02,46.04 13.02,45.4 12.06,44.45 IC12.1
SR8_ROW8_SET
  Bottom 0.305: IC12.18 12.06,54.61 12.7,55.24 12.7,63.5 15.88,66.67 15.88,68.26 16.83,69.22 16.83,69.53 X5.8
SR9  (via drill 0.51)
  Top 0.254: v18.41,53.34 19.68,54.61 21.59,54.61 22.54,53.66 22.54,53.02 IC4.15
  Bottom 0.254: v18.41,53.34 18.73,53.02 18.73,49.85 20.32,48.26 20.32,44.77 20.64,44.45 IC11.8
SR9_ROW9_SET
  Bottom 0.254: IC11.11 20.64,54.61 20.32,54.93 20.32,66.36 19.68,66.99 X5.9
SR10  (via drill 0.51)
  Top 0.254: v21.91,46.35 21.91,47.94 21.27,47.94 IC4.1
  Bottom 0.254: v21.91,46.35 21.91,44.45 IC11.7
SR10_ROW10_SET
  Bottom 0.254: IC11.12 21.91,54.61 21.59,54.93 21.59,66.04 20.95,66.67 20.95,68.26 19.68,69.53 X5.10
SR11  (via drill 0.51)
  Top 0.254: v23.18,46.35 23.18,47.94 22.54,47.94 IC4.2
  Bottom 0.254: v23.18,46.35 23.18,44.45 IC11.6
SR11_ROW11_SET
  Bottom 0.254: IC11.13 23.18,54.61 22.86,54.93 22.86,66.36 22.23,66.99 X5.11
SR12  (via drill 0.51)
  Top 0.254: v24.45,46.35 24.45,47.94 23.81,47.94 IC4.3
  Bottom 0.254: v24.45,46.35 24.45,44.45 IC11.5
SR12_ROW12_SET
  Bottom 0.254: IC11.14 24.45,54.61 24.13,54.93 24.13,66.04 23.5,66.67 23.5,68.26 22.23,69.53 X5.12
SR13  (via drill 0.51)
  Top 0.254: v25.72,46.35 25.72,47.94 25.08,47.94 IC4.4
  Bottom 0.254: v25.72,46.35 25.72,44.45 IC11.4
SR13_ROW13_SET
  Bottom 0.254: IC11.15 25.72,54.61 25.4,54.93 25.4,66.36 24.77,66.99 X5.13
SR14  (via drill 0.51)
  Top 0.254: v26.99,46.35 26.99,47.94 26.35,47.94 IC4.5
  Bottom 0.254: v26.99,46.35 26.99,44.45 IC11.3
SR14_ROW14_SET
  Bottom 0.254: IC11.16 26.99,54.61 26.67,54.93 26.67,66.04 26.04,66.67 26.04,68.26 24.77,69.53 X5.14
SR15  (via drill 0.51)
  Top 0.254: v28.26,46.35 28.26,47.94 27.62,47.94 IC4.6
  Bottom 0.254: v28.26,46.35 28.26,44.45 IC11.2
SR15_ROW15_SET
  Bottom 0.254: IC11.17 28.26,54.61 27.94,54.93 27.94,66.36 27.3,66.99 X5.15
SR16  (via drill 0.51)
  Top 0.254: v29.53,46.35 29.53,47.94 28.89,47.94 IC4.7
  Bottom 0.254: v29.53,46.35 29.53,44.45 IC11.1
SR16_ROW16_SET
  Bottom 0.254: IC11.18 29.53,54.61 29.21,54.93 29.21,66.04 28.57,66.67 28.57,68.26 27.3,69.53 X5.16
SR17  (via drill 0.51)
  Top 0.254: v40.01,50.8 45.4,50.8 46.67,52.07 46.67,52.7 IC5.15
  Bottom 0.254: v40.01,50.8 40.01,44.45 IC10.8
SR17_ROW17_SET  (via drill 0.51)
  Top 0.254: v37.15,60.01 36.83,60.33 36.51,60.33 29.84,66.99 X5.17
  Bottom 0.254: v37.15,60.01 40.01,57.15 40.01,54.61 IC10.11
SR18  (via drill 0.51)
  Top 0.254: v41.59,46.35 43.18,47.94 45.4,47.94 IC5.1
  Bottom 0.254: v41.59,46.35 41.59,44.77 41.27,44.45 IC10.7
SR18_ROW18_SET  (via drill 0.51)
  Top 0.254: v41.27,72.39 40.96,72.07 32.07,72.07 29.84,69.85 X5.18
  Bottom 0.254: v41.27,72.39 41.27,54.61 IC10.12
SR19  (via drill 0.51)
  Top 0.254: v47.31,50.16 47.31,48.26 46.99,48.26 IC5.2
  Bottom 0.254: v47.31,50.16 42.86,45.72 42.86,44.77 42.55,44.45 IC10.6
SR19_ROW19_SET  (via drill 0.51)
  Top 0.254: v42.55,64.45 36.2,64.45 35.56,65.09 35.56,66.04 36.2,66.67 36.2,68.26 34.29,68.26 33.34,67.31 32.38,67.31 X5.19
  Bottom 0.254: v42.55,64.45 42.55,54.61 IC10.13
SR20  (via drill 0.51)
  Top 0.254: v48.26,46.35 48.26,47.94 IC5.3
  Bottom 0.254: IC10.5 43.81,44.45 44.77,44.45 IC10.4 45.09,44.45 46.04,44.45 IC10.3 46.35,44.45 47.31,44.45 IC10.2 47.62,44.45 48.26,44.45 | 48.26,44.45 48.58,44.45 IC10.1 | 48.26,44.45 v48.26,46.35
SR20_ROW20_SET  (via drill 0.51)
  Top 0.254: v43.81,71.44 33.97,71.44 32.38,69.85 X5.20
  Bottom 0.254: IC10.18 48.58,54.29 47.62,54.29 IC10.17 47.31,54.29 46.35,54.29 IC10.16 46.04,54.29 45.09,54.29 IC10.15 44.77,54.29 43.81,54.29 IC10.14 43.81,54.61 v43.81,71.44
SR21  (via drill 0.51)
  Top 0.254: v53.66,50.16 49.53,50.16 49.53,48.26 IC5.4
  Bottom 0.254: IC15.4 58.74,44.77 57.78,44.77 IC15.5 57.47,44.77 56.52,44.77 IC15.6 56.2,44.77 55.24,44.77 IC15.7 54.93,44.77 53.98,44.77 IC15.8 53.66,44.77 v53.66,50.16
SR21_ROW1_RST  (via drill 0.51)
  Top 0.254: v53.98,63.5 42.23,63.5 41.91,63.82 34.92,63.82 34.92,66.99 X5.21
  Bottom 0.254: IC15.15 58.74,53.98 57.78,53.98 IC15.14 57.47,53.98 56.52,53.98 IC15.13 56.2,53.98 55.24,53.98 IC15.12 54.93,53.98 53.98,53.98 IC15.11 53.98,54.29 v53.98,63.5
SR22  (via drill 0.51)
  Top 0.254: v60.33,42.86 57.78,45.4 52.7,45.4 50.8,47.31 50.8,47.94 IC5.5
  Bottom 0.254: v60.33,42.86 60.33,44.45 IC15.3
SR22_ROW2_RST  (via drill 0.51)
  Top 0.254: v60.33,60.96 60.01,61.28 48.26,61.28 47.94,61.59 39.69,61.59 39.05,60.96 36.83,60.96 31.11,66.67 31.11,68.58 33.66,68.58 34.61,69.53 X5.22
  Bottom 0.254: v60.33,60.96 60.33,54.29 IC15.16
SR23  (via drill 0.51)
  Top 0.254: v61.59,42.86 58.42,46.04 53.34,46.04 52.07,47.31 52.07,47.94 IC5.6
  Bottom 0.254: v61.59,42.86 61.59,44.45 IC15.2
SR23_ROW3_RST  (via drill 0.51)
  Top 0.254: v61.28,62.55 48.9,62.55 48.58,62.87 v37.78,62.87
  Bottom 0.254: v61.28,62.55 61.28,54.29 IC15.17 | v37.78,62.87 37.47,63.18 37.47,66.99 X5.23
SR24  (via drill 0.51)
  Top 0.254: v62.23,46.67 53.98,46.67 53.34,47.31 53.34,47.94 IC5.7
  Bottom 0.254: v62.23,46.67 62.23,45.09 62.55,44.77 IC15.1
SR24_ROW4_RST  (via drill 0.51)
  Top 0.254: v62.23,60.96 61.59,61.59 60.96,61.59 60.64,61.91 48.58,61.91 48.26,62.23 39.05,62.23 v38.73,61.91
  Bottom 0.254: v62.23,60.96 62.23,54.61 62.55,54.29 IC15.18 | v38.73,61.91 38.73,68.26 37.47,69.53 X5.24
SR25  (via drill 0.51)
  Top 0.254: v74.93,51.75 75.25,51.44 77.47,51.44 78.42,52.39 78.42,52.7 IC6.15
  Bottom 0.254: v74.93,51.75 74.93,47.31 76.2,46.04 76.2,45.09 76.52,44.77 IC14.8
SR25_ROW5_RST  (via drill 0.51)
  Top 0.254: v72.71,60.01 71.75,60.96 v67.94,60.96 | v66.67,59.05 66.36,59.37 58.74,59.37 58.1,60.01 48.26,60.01 47.94,59.69 v40.32,59.69
  Bottom 0.254: v72.71,60.01 76.2,56.52 76.2,54.61 76.52,54.29 IC14.11 | v67.94,60.96 66.67,59.69 v66.67,59.05 | v40.32,59.69 40.01,60.01 40.01,66.99 X5.25
SR26  (via drill 0.51)
  Top 0.254: v75.88,47.62 76.2,47.94 77.15,47.94 IC6.1
  Bottom 0.254: v75.88,47.62 77.47,46.04 77.47,45.09 77.79,44.77 IC14.7
SR26_ROW6_RST  (via drill 0.51)
  Top 0.254: v86.36,72.71 51.44,72.71 50.8,72.07 45.72,72.07 44.13,70.48 43.5,70.48 43.18,70.8 40.96,70.8 40.01,69.85 X5.26
  Bottom 0.254: v86.36,72.71 86.36,52.7 78.74,52.7 78.42,53.02 78.42,53.66 78.11,53.98 IC14.12
SR27  (via drill 0.51)
  Top 0.254: v79.06,42.86 79.06,47.94 78.42,47.94 IC6.2
  Bottom 0.254: v79.06,42.86 79.06,44.45 IC14.6
SR27_ROW7_RST  (via drill 0.51)
  Top 0.254: v72.71,63.5 72.07,64.14 61.91,64.14 61.59,64.45 55.24,64.45 54.61,65.09 52.39,65.09 52.07,64.77 46.04,64.77 44.77,66.04 43.5,66.04 42.55,66.99 X5.27
  Bottom 0.254: v72.71,63.5 72.71,61.59 78.74,55.56 78.74,54.61 79.06,54.29 IC14.13
SR28  (via drill 0.51)
  Top 0.254: v80.33,42.86 80.33,47.94 79.69,47.94 IC6.3
  Bottom 0.254: v80.33,42.86 80.33,44.45 IC14.5
SR28_ROW8_RST  (via drill 0.51)
  Top 0.254: v80.01,74.61 79.69,74.3 v45.4,74.3
  Bottom 0.254: v80.01,74.61 84.45,70.17 84.45,66.67 80.96,63.18 80.96,54.61 80.64,54.29 IC14.14 | v45.4,74.3 42.55,71.44 42.55,69.85 X5.28
SR29  (via drill 0.51)
  Top 0.254: v81.6,42.86 81.6,47.94 80.96,47.94 IC6.4
  Bottom 0.254: v81.6,42.86 81.6,44.45 IC14.4
SR29_ROW9_RST  (via drill 0.51)
  Top 0.254: v81.92,59.69 79.06,62.55 62.55,62.55 61.28,63.82 54.93,63.82 54.29,64.45 52.7,64.45 52.39,64.14 45.4,64.14 v45.09,64.45
  Bottom 0.254: v81.92,59.69 81.92,54.29 IC14.15 | v45.09,64.45 45.09,66.99 X5.29
SR30  (via drill 0.51)
  Top 0.254: v82.87,42.86 82.87,47.94 82.23,47.94 IC6.5
  Bottom 0.254: v82.87,42.86 82.87,44.45 IC14.3
SR30_ROW10_RST  (via drill 0.51)
  Top 0.254: v85.09,73.66 83.19,75.56 48.26,75.56 v47.94,75.25
  Bottom 0.254: v85.09,73.66 85.09,66.36 83.5,64.77 83.5,54.61 83.19,54.29 IC14.16 | v47.94,75.25 45.09,72.39 45.09,69.85 X5.30
SR31  (via drill 0.51)
  Top 0.254: v84.14,50.16 84.14,48.26 83.5,48.26 IC6.6
  Bottom 0.254: v84.14,50.16 84.14,44.77 IC14.2
SR31_ROW11_RST  (via drill 0.51)
  Top 0.254: v84.45,55.88 78.42,61.91 64.45,61.91 62.55,60.01 59.05,60.01 58.42,60.64 v47.62,60.64
  Bottom 0.254: v84.45,55.88 84.45,54.29 IC14.17 | v47.62,60.64 47.62,66.99 X5.31
SR32  (via drill 0.51)
  Top 0.254: v85.41,50.16 85.41,48.26 84.77,48.26 IC6.7
  Bottom 0.254: v85.41,50.16 85.41,44.77 IC14.1
SR32_ROW12_RST  (via drill 0.51)
  Top 0.254: v85.41,57.47 78.11,64.77 71.12,64.77 69.22,66.67 69.22,68.58 62.23,68.58 61.59,69.22 61.59,70.8 48.58,70.8 47.62,69.85 X5.32
  Bottom 0.254: v85.41,57.47 85.41,54.29 IC14.18
SR33  (via drill 0.51)
  Top 0.254: v28.26,30.16 29.84,31.75 29.84,32.38 IC7.15
  Bottom 0.254: v28.26,30.16 28.26,24.45 IC13.8
SR33_ROW13_RST  (via drill 0.51)
  Top 0.254: v28.89,37.47 32.07,40.64 v34.61,40.64
  Bottom 0.254: v28.89,37.47 28.89,34.29 28.57,33.97 IC13.11 | v34.61,40.64 34.61,53.66 34.92,53.98 34.92,57.78 34.61,58.1 34.61,65.09 36.2,66.67 36.2,70.17 42.23,76.2 48.9,76.2 48.9,68.26 49.85,67.31 X5.33
SR34  (via drill 0.51)
  Top 0.254: v29.53,29.84 29.53,29.21 28.89,28.57 28.89,27.94 IC7.1
  Bottom 0.254: v29.53,29.84 29.53,24.45 IC13.7
SR34_ROW14_RST  (via drill 0.51)
  Top 0.254: v30.48,57.78 30.48,61.91 28.57,63.82 28.57,71.75 v30.48,71.75
  Bottom 0.254: v30.48,57.78 30.48,43.18 30.16,42.86 30.16,34.29 29.84,33.97 IC13.12 | v30.48,71.75 34.29,71.75 39.37,76.83 49.85,76.83 49.85,69.85 X5.34
SR35  (via drill 0.51)
  Top 0.254: v30.8,29.84 30.8,29.21 30.16,28.57 30.16,27.94 IC7.2
  Bottom 0.254: v30.8,29.84 30.8,24.45 IC13.6
SR35_ROW15_RST  (via drill 0.51)
  Top 0.254: v31.43,42.55 55.24,42.55 56.83,40.96 v62.87,40.96
  Bottom 0.254: v31.43,42.55 31.43,34.29 31.11,33.97 IC13.13 | v62.87,40.96 63.82,41.91 63.82,46.35 57.47,52.7 51.75,52.7 51.75,64.45 52.7,65.41 52.7,66.99 X5.35
SR36  (via drill 0.51)
  Top 0.254: v32.07,29.84 32.07,29.21 31.43,28.57 31.43,27.94 IC7.3
  Bottom 0.254: v32.07,29.84 32.07,24.45 IC13.5
SR36_ROW16_RST  (via drill 0.51)
  Top 0.254: v32.7,46.67 33.02,46.99 v38.1,46.99 | v39.05,56.83 39.37,57.15 v45.4,57.15
  Bottom 0.254: v32.7,46.67 32.7,34.29 32.38,33.97 IC13.14 | v38.1,46.99 37.78,47.31 37.78,55.56 v39.05,56.83 | v45.4,57.15 50.48,62.23 50.48,65.72 51.44,66.67 51.44,68.58 52.39,69.53 X5.36
SR37  (via drill 0.51)
  Top 0.254: v33.34,29.84 33.34,29.21 32.7,28.57 32.7,27.94 IC7.4
  Bottom 0.254: v33.34,29.84 33.34,24.45 IC13.4
SR37_ROW17_RST  (via drill 0.51)
  Top 0.254: v25.72,32.38 24.77,31.43 15.56,31.43 v13.65,33.34 | v13.65,59.37 20.95,66.67 20.95,73.34 v50.8,73.34
  Bottom 0.254: v25.72,32.38 33.02,32.38 33.02,33.34 33.34,33.66 IC13.15 | v13.65,33.34 13.97,33.66 13.97,47.94 12.38,49.53 12.38,52.7 13.65,53.98 v13.65,59.37 | v50.8,73.34 53.98,70.17 53.98,68.26 54.93,67.31 X5.37
SR38  (via drill 0.51)
  Top 0.254: v34.61,29.84 34.61,29.21 33.97,28.57 33.97,27.94 IC7.5
  Bottom 0.254: v34.61,29.84 34.61,24.45 IC13.3
SR38_ROW18_RST  (via drill 0.51)
  Top 0.254: v89.85,8.26 v45.4,8.26
  Bottom 0.254: v45.4,8.26 45.4,8.57 42.23,11.75 42.23,30.8 37.15,30.8 35.24,32.7 35.24,33.34 34.92,33.66 IC13.16 | v89.85,8.26 93.03,11.43 93.03,70.17 87,76.2 55.24,76.2 55.24,69.85 X5.38
SR39  (via drill 0.51)
  Top 0.254: v35.88,29.84 35.88,29.21 35.24,28.57 35.24,27.94 IC7.6
  Bottom 0.254: v35.88,29.84 35.88,24.45 IC13.2
SR39_ROW19_RST  (via drill 0.51)
  Top 0.254: v37.15,56.83 38.42,58.1 v56.2,58.1
  Bottom 0.254: v37.15,56.83 37.15,46.67 37.47,46.35 37.47,40.32 36.51,39.37 36.51,34.29 36.2,33.97 IC13.17 | v56.2,58.1 56.83,58.74 56.83,66.04 57.47,66.67 57.47,66.99 X5.39
SR40  (via drill 0.51)
  Top 0.254: v37.15,29.84 37.15,29.21 36.51,28.57 36.51,27.94 IC7.7
  Bottom 0.254: v37.15,29.84 37.15,24.45 IC13.1
SR40_ROW20_RST  (via drill 0.51)
  Top 0.254: v40.96,37.47 41.27,37.15 v66.04,37.15
  Bottom 0.254: v40.96,37.47 37.47,33.97 IC13.18 | v66.04,37.15 65.72,37.47 65.72,65.72 66.67,66.67 66.67,70.17 65.72,71.12 57.78,71.12 57.78,69.85 X5.40
SR41_D@FP2800A  (via drill 0.51)
  Top 0.254: IC8.15 v48.9,35.56
  Bottom 0.254: v48.9,35.56 48.9,23.18 47.62,23.18 47.62,23.81 46.99,24.45 IC17.8
SR41_D@FP2800A_24V  (via drill 0.51)
  Top 0.254: v46.99,40.01 46.35,40.64 v36.51,40.64 | v36.2,58.74 55.56,58.74 55.88,59.05 v57.78,59.05 | v59.37,65.41 60.01,66.04 66.67,66.04 67.63,66.99 X5.47
  Bottom 0.254: v46.99,40.01 IC17.11 | v36.51,40.64 36.51,56.2 36.2,56.52 v36.2,58.74 | v57.78,59.05 59.37,60.64 v59.37,65.41
SR42_A0@FP2800A  (via drill 0.51)
  Top 0.254: v46.35,27.3 46.67,27.62 47.62,27.62 IC8.1
  Bottom 0.254: v46.35,27.3 47.62,26.04 47.62,25.4 48.26,24.77 IC17.7
SR42_A0@FP2800A_24V  (via drill 0.51)
  Top 0.254: v44.45,24.45 46.04,22.86 48.9,22.86 49.85,21.91 61.28,21.91 62.87,23.5 v77.15,23.5
  Bottom 0.254: v44.45,24.45 44.45,26.67 47.62,29.84 47.62,33.02 48.26,33.66 IC17.12 | v77.15,23.5 80.64,26.99 80.64,28.57 80.01,29.21 77.79,29.21 77.79,31.43 78.11,31.75 80.96,31.75 80.96,32.7 81.92,33.66 89.22,33.66 89.22,73.03 86.68,75.56 67.94,75.56 67.94,69.85 X5.48
SR43_A1@FP2800A  (via drill 0.51)
  Top 0.254: v50.16,22.86 50.16,26.35 49.85,26.35 48.9,27.3 IC8.2
  Bottom 0.254: v50.16,22.86 50.16,23.81 49.53,24.45 IC17.6
SR43_A1@FP2800A_24V  (via drill 0.51)
  Top 0.254: v62.87,42.86 66.67,46.67 v70.17,46.67
  Bottom 0.254: v62.87,42.86 62.87,41.91 60.01,41.91 59.37,42.55 59.37,42.86 56.83,42.86 53.98,40.01 53.98,38.73 52.7,37.47 52.7,32.38 50.48,32.38 50.16,32.7 50.16,33.02 49.53,33.66 IC17.13 | v70.17,46.67 70.17,66.99 X5.49
SR44_A2@FP2800A  (via drill 0.51)
  Top 0.254: v51.44,22.86 51.44,26.35 51.12,26.35 50.16,27.3 IC8.3
  Bottom 0.254: v51.44,22.86 51.44,23.81 50.8,24.45 IC17.5
SR44_A2@FP2800A_24V  (via drill 0.51)
  Top 0.254: v51.44,43.5 50.16,44.77 v35.56,44.77 | v36.51,65.41 37.15,66.04 40.64,66.04 41.27,66.67 41.27,68.58 45.72,68.58 46.35,69.22 46.35,71.44 68.58,71.44 70.17,69.85 X5.50
  Bottom 0.254: v51.44,43.5 51.44,41.27 51.12,40.96 51.12,34.29 50.8,33.97 IC17.14 | v35.56,44.77 35.56,58.1 35.24,58.42 35.24,64.14 v36.51,65.41
SR45_B0@FP2800A  (via drill 0.51)
  Top 0.254: v52.7,22.86 52.7,26.35 52.39,26.35 51.44,27.3 IC8.4
  Bottom 0.254: v52.7,22.86 52.7,23.81 52.07,24.45 IC17.4
SR45_B0@FP2800A_24V  (via drill 0.51)
  Top 0.254: v81.28,38.1 v52.07,38.1 | v85.72,42.86 93.03,50.16 93.03,57.15 87,57.15 78.74,65.41 74.61,65.41 73.03,66.99 X5.51
  Bottom 0.254: v52.07,38.1 IC17.15 | v81.28,38.1 85.72,42.55 v85.72,42.86
SR46_B1@FP2800A  (via drill 0.51)
  Top 0.254: v53.98,22.86 53.98,26.35 53.66,26.35 52.7,27.3 IC8.5
  Bottom 0.254: v53.98,22.86 53.98,23.81 53.34,24.45 IC17.3
SR46_B1@FP2800A_24V  (via drill 0.51)
  Top 0.254: v60.96,14.29 66.36,8.89 83.19,8.89 v90.49,16.19 | v90.17,70.48 88.9,71.75 v74.93,71.75
  Bottom 0.254: v60.96,14.29 60.96,23.18 53.98,30.16 53.98,33.02 53.34,33.66 IC17.16 | v90.49,16.19 90.17,16.51 v90.17,70.48 | v74.93,71.75 73.03,69.85 X5.52
SR47_ADDR1@FP2800A  (via drill 0.51)
  Top 0.254: v55.24,22.86 55.24,26.35 54.93,26.35 53.98,27.3 IC8.6
  Bottom 0.254: v55.24,22.86 55.24,23.81 54.61,24.45 IC17.2
SR47_ADDR1@FP2800A_24V  (via drill 0.51)
  Top 0.254: v57.15,41.91 66.67,41.91 v70.17,45.4
  Bottom 0.254: IC17.17 54.61,39.37 v57.15,41.91 | v70.17,45.4 71.12,46.35 71.12,66.04 71.75,66.67 71.75,67.63 72.39,68.26 75.25,68.26 75.25,67.31 X5.53
SR48_ADDR2@FP2800A  (via drill 0.51)
  Top 0.254: v56.83,26.04 56.52,26.35 56.2,26.35 55.24,27.3 IC8.7
  Bottom 0.254: v56.83,26.04 56.83,25.72 55.88,24.77 IC17.1
SR48_ADDR2@FP2800A_24V  (via drill 0.51)
  Top 0.254: v63.18,22.54 64.14,21.59 75.56,21.59 80.33,16.83 80.33,12.38 85.41,12.38 v91.12,18.1 | v91.12,58.1 83.19,66.04 77.47,66.04 76.83,66.67 76.83,69.53 75.56,69.53 X5.54
  Bottom 0.254: v63.18,22.54 62.55,23.18 62.55,32.07 62.87,32.38 62.87,33.66 55.88,33.66 IC17.18 | v91.12,58.1 v91.12,18.1
SR49_ADDR3@FP2800A  (via drill 0.51)
  Top 0.254: IC9.15 67.94,33.97 67.31,33.97 66.67,34.61 v66.04,34.61
  Bottom 0.254: 67.31,23.18 66.04,23.18 IC16.8 66.04,23.5 65.41,24.13 65.41,33.97 v66.04,34.61 | 67.31,23.18 68.58,23.18 IC16.6 | 67.31,23.18 IC16.7
SR49_ADDR3@FP2800A_24V  (via drill 0.51)
  Top 0.254: v67.63,57.78 67.94,57.47 v78.11,57.47
  Bottom 0.254: 67.31,32.7 66.04,32.7 IC16.11 | 67.31,32.7 67.94,32.7 | 67.94,32.7 68.58,32.7 IC16.13 | 67.31,32.7 IC16.12 | 67.94,32.7 67.94,57.47 v67.63,57.78 | v78.11,57.47 78.11,66.99 X5.55
SR50_ADDR4@FP2800A  (via drill 0.51)
  Top 0.254: v69.22,26.04 68.9,26.35 67.63,26.35 66.67,27.3 IC9.1
  Bottom 0.254: v69.22,26.04 69.22,24.13 69.85,23.5 IC16.5
SR50_ADDR4@FP2800A_24V  (via drill 0.51)
  Top 0.254: v70.48,71.44 71.12,70.8 76.83,70.8 77.79,69.85 X5.56
  Bottom 0.254: v70.48,71.44 69.22,70.17 69.22,60.96 68.26,60.01 68.26,58.42 68.58,58.1 68.58,44.77 69.22,44.13 69.22,33.34 69.85,32.7 IC16.14
SR51_ADDR5@FP2800A  (via drill 0.51)
  Top 0.254: v69.22,29.84 67.94,28.57 IC9.2
  Bottom 0.254: v69.22,29.84 70.8,28.26 70.8,23.81 71.12,23.5 IC16.4
SR51_ADDR5@FP2800A_24V
  Bottom 0.254: IC16.15 71.12,45.4 71.75,46.04 71.75,63.82 73.98,66.04 76.83,66.04 76.83,70.17 77.47,70.8 81.92,70.8 81.92,68.58 80.64,67.31 X5.57
SR52_ADDR6@FP2800A  (via drill 0.51)
  Top 0.254: v71.44,29.84 71.12,29.53 70.17,29.53 69.22,28.57 IC9.3
  Bottom 0.254: v71.44,29.84 71.44,25.08 71.75,24.77 71.75,24.13 72.39,23.5 IC16.3
SR52_ADDR6@FP2800A_24V  (via drill 0.51)
  Top 0.254: v69.22,58.74 69.53,58.42 v79.06,58.42
  Bottom 0.254: v69.22,58.74 69.22,45.09 70.48,43.81 70.48,31.11 71.44,31.11 71.75,31.43 71.75,31.75 72.39,32.38 IC16.16 | v79.06,58.42 79.38,58.74 79.38,68.58 80.33,69.53 X5.58
SR53_ADDR7@FP2800A  (via drill 0.51)
  Top 0.254: v73.66,26.04 73.34,26.35 71.44,26.35 70.48,27.3 IC9.4
  Bottom 0.254: v73.66,26.04 IC16.2
SR53_ADDR7@FP2800A_24V  (via drill 0.51)
  Top 0.254: v79.38,40.01 80.64,41.27 85.41,41.27 93.66,49.53 93.66,67.31 83.19,67.31 X5.59
  Bottom 0.254: v79.38,40.01 74.3,34.92 74.3,33.34 73.66,32.7 IC16.17
SR54_LED_A  (via drill 0.51)
  Top 0.254: v84.45,31.43 83.82,30.8 73.98,30.8 71.75,28.57 IC9.5
  Bottom 0.254: v84.45,31.43 84.45,24.13 R8.1
SR55_LED_B  (via drill 0.51)
  Top 0.254: v85.41,30.48 85.09,30.16 74.61,30.16 73.03,28.57 IC9.6
  Bottom 0.254: v85.41,30.48 85.41,29.21 85.72,28.89 85.72,20 84.77,19.05 R7.1
SR56_LED_C  (via drill 0.51)
  Top 0.254: v86.36,29.53 75.25,29.53 74.3,28.57 IC9.7
  Bottom 0.254: v86.36,29.53 86.36,15.56 84.77,13.97 R6.1
SRCLK
  Top 0.254: IC1.12 6.99,14.29 5.4,14.29 4.76,13.65 4.76,7.94 7.62,7.94 9.21,6.35 MCU1.D5
SRCLK_5V  (via drill 0.51)
  Top 0.254: IC1.8 8.26,19.05 29.84,19.05 36.2,25.4 46.99,25.4 48.26,26.67 48.26,29.53 46.99,29.53 46.67,29.21 44.13,29.21 | 44.13,29.21 39.05,29.21 37.15,31.11 35.88,31.11 35.24,31.75 35.24,32.38 IC7.11 | IC8.11 53.98,34.29 52.39,34.29 52.07,33.97 52.07,31.11 46.04,31.11 45.4,30.48 | 44.13,29.21 45.4,30.48 | IC9.11 73.03,34.61 v72.07,34.61 | v82.23,51.12 83.5,52.39 83.5,52.7 IC6.11 | v16.51,52.7 15.24,51.44 10.16,51.44 10.16,52.7 IC3.11 | v16.83,56.83 17.14,56.52 24.77,56.52 26.67,54.61 | 26.67,54.61 27.62,53.66 27.62,53.02 IC4.11 | v48.26,51.12 51.75,51.12 51.75,52.7 IC5.11 | v40.96,51.75 40.01,52.7 32.38,52.7 30.48,54.61 26.67,54.61 | v50.16,40.01 v72.07,40.01 | v45.09,30.8 45.4,30.48
  Bottom 0.254: v72.07,34.61 73.03,35.56 73.03,40.01 | 73.03,40.01 73.03,52.07 73.66,52.7 77.79,52.7 79.38,51.12 v82.23,51.12 | v16.51,52.7 16.83,53.02 v16.83,56.83 | v40.96,51.75 40.96,51.12 v48.26,51.12 49.53,49.85 49.53,40.96 | v72.07,40.01 73.03,40.01 | v50.16,40.01 49.53,40.64 49.53,40.96 | v45.09,30.8 45.09,39.37 46.67,40.96 49.53,40.96
VCC  (via drill 0.51)
  Top 0.254: 30.8,56.2 33.66,53.34 45.09,53.34 45.4,53.02 IC5.16 | 30.8,56.2 29.21,57.78 v17.78,57.78 3.81,57.78 3.81,53.02 IC3.16 | v66.99,53.66 76.52,53.66 77.15,53.02 IC6.16 | v66.67,56.83 v64.77,56.83 46.35,56.83 45.4,55.88 33.66,55.88 33.34,56.2 30.8,56.2 | LED1.A 81.6,13.97 81.6,18.73 LED2.A 81.6,19.05 81.6,23.81 LED3.A | 81.28,24.45 81.28,24.13 LED3.A | 81.28,24.45 v81.28,26.04 | JP3.2 55.88,8.89 46.04,8.89 45.72,9.21 44.45,9.21 41.91,6.67 32.7,6.67 27.62,11.75 v23.18,11.75 18.1,11.75 17.14,12.7 IC1.20 | v23.81,27.94 24.13,27.94 28.57,32.38 IC7.16 | v17.78,52.07 20.64,52.07 21.27,52.7 IC4.16 | IC8.16 46.67,31.75 v42.55,31.75 | v61.91,32.7 IC9.16 | v61.59,24.45 81.28,24.45 | 81.28,24.45 LED3.A
  Bottom 0.254: v66.99,53.66 66.67,53.98 v66.67,56.83 | v64.77,56.83 64.77,66.67 65.09,66.99 X5.45 | 81.28,30.8 82.23,30.8 82.23,31.75 R5.1 | 81.28,30.8 79.38,30.8 R4.1 | v81.28,26.04 81.28,30.8 | v23.18,11.75 23.18,27.3 v23.81,27.94 23.81,28.26 18.1,33.97 18.1,51.75 v17.78,52.07 17.46,52.39 17.46,53.66 17.78,53.98 v17.78,57.78 | v42.55,31.75 42.86,31.43 42.86,12.06 46.04,8.89 58.42,8.89 58.42,10.16 | JP3.2 58.42,10.48 | 58.42,10.48 58.42,10.16 | 61.91,24.45 61.91,13.97 58.42,10.48 | 61.91,24.45 v61.91,32.7 | 58.42,10.16 X2.1 | 61.91,24.45 v61.59,24.45
VCC_SW  (via drill 0.51)
  Top 0.254: v22.23,18.1 33.02,7.3 41.59,7.3 45.72,11.43 55.88,11.43 JP3.1
  Bottom 0.254: v22.23,18.1 22.23,26.35 19.68,28.89 MCU1.5V
VS  (via drill 0.51)
  Top 0.305: v73.66,55.88 v53.02,55.88 v50.16,55.88 | v2.22,42.55 v19.68,42.55 20.64,41.59 v38.73,41.59 v50.48,41.59
  Bottom 0.305: IC15.10 52.7,54.29 53.02,54.61 v53.02,55.88 53.02,64.14 54.93,66.04 56.2,66.04 56.2,66.36 56.52,66.67 56.52,67.63 57.47,68.58 62.55,68.58 62.55,69.53 X5.44 | v73.66,55.88 75.25,54.29 IC14.10 | IC13.10 26.99,33.97 19.68,41.27 v19.68,42.55 19.68,44.13 IC11.9 | v2.22,42.55 2.22,43.81 1.91,44.13 IC12.9 | 39.69,42.55 43.5,38.73 43.5,13.65 JP4.1 | 39.69,42.55 39.05,43.18 39.05,43.81 38.73,44.13 IC10.9 | 39.69,42.55 v38.73,41.59 | v50.16,55.88 50.48,55.56 v50.48,41.59
VS_SW  (via drill 0.51)
  Top 0.305: PAD2.1 37.78,19.05 IC2.8 38.1,19.05 38.1,21.59 v46.35,21.59 | v51.44,17.14 54.93,17.14 56.83,19.05 C3.1
  Bottom 0.305: JP4.2 51.12,16.83 | 51.12,16.83 v46.35,21.59 | 51.12,16.83 v51.44,17.14
~EN_ADDR8@FP2800A  (via drill 0.51)
  Top 0.254: 13.34,12.7 12.06,12.7 IC1.16 v12.06,14.61 | 13.34,12.7 14.61,12.7 IC1.18 | 13.34,12.7 IC1.17
  Bottom 0.254: v12.06,14.61 12.06,28.89 MCU1.D3
~EN_ADDR8@FP2800A_5V  (via drill 0.51)
  Top 0.254: 14.61,22.86 13.34,22.86 IC1.4 | 14.61,22.86 15.88,22.86 IC1.2 15.88,20 v25.72,20 | 14.61,22.86 IC1.3
  Bottom 0.254: R4.2 79.06,27.62 74.93,23.5 IC16.1 74.93,23.18 76.2,21.91 76.2,1.91 42.55,1.91 31.43,13.02 31.43,14.29 v25.72,20
~EN_ADDR8@FP2800A_24V  (via drill 0.51)
  Top 0.254: v79.38,32.7 94.3,47.62 94.3,69.53 83.19,69.53 X5.60
  Bottom 0.254: v79.38,32.7 74.93,32.7 IC16.18
~EN_POWER_RAILS  (via drill 0.51)
  Top 0.254: IC1.1 17.14,26.99 v8.57,26.99 | 25.4,5.4 19.68,11.11 16.83,11.11 | 16.83,11.11 15.88,12.06 IC1.19 | v41.59,11.11 41.59,13.65 IC2.4 | 25.4,5.4 41.27,5.4 v41.59,5.71 41.91,5.71 42.55,6.35 82.55,6.35 X4.1 | 25.4,5.4 R3.2 | v13.34,10.79 13.65,11.11 16.83,11.11
  Bottom 0.254: MCU1.D1 6.99,28.89 6.99,28.57 v8.57,26.99 8.89,26.67 8.89,15.24 v13.34,10.79 | v41.59,5.71 v41.59,11.11
~OE
  Top 0.254: IC1.14 9.53,9.21 15.56,9.21 18.1,6.67 18.1,5.08 15.56,5.08 14.61,6.03 MCU1.D7
~OE_5V  (via drill 0.51)
  Top 0.254: 14.61,55.88 22.86,55.88 25.08,53.66 25.08,53.02 IC4.13 | 14.61,55.88 7.62,55.88 7.62,53.02 IC3.13 | IC1.6 10.79,24.45 13.97,24.45 v15.56,26.04 | v18.41,32.38 21.27,35.24 31.11,35.24 32.38,33.97 32.38,32.7 IC7.13 | v14.61,55.56 14.61,55.88 | v75.88,35.24 75.56,35.56 71.75,35.56 70.48,34.29 | IC9.13 70.48,34.29 | v77.79,42.86 76.2,44.45 74.93,44.45 74.93,47.94 76.83,49.85 80.96,49.85 80.96,52.7 IC6.13 | v33.97,54.29 34.29,54.61 49.21,54.61 49.21,53.02 IC5.13 | v35.56,36.51 50.48,36.51 50.8,36.2 | 50.8,36.2 51.44,35.56 IC8.13 | 70.48,34.29 68.58,36.2 50.8,36.2
  Bottom 0.254: 15.88,26.35 18.41,28.89 v18.41,32.38 | 15.88,26.35 15.88,29.21 15.24,29.84 15.24,48.9 14.29,49.85 14.29,55.24 v14.61,55.56 15.88,56.83 15.88,64.14 18.41,66.67 18.41,70.17 19.05,70.8 31.11,70.8 31.11,58.42 33.97,55.56 v33.97,54.29 33.66,53.98 33.66,38.42 v35.56,36.51 | 15.88,26.35 v15.56,26.04 | 80.33,34.92 75.88,34.92 v75.88,35.24 | 80.33,34.92 82.23,34.92 R5.2 | v77.79,42.86 80.33,40.32 80.33,34.92
~SRCLR
  Top 0.254: IC1.11 5.71,8.57 14.61,8.57 16.83,6.35 MCU1.D8
~SRCLR_5V  (via drill 0.51)
  Top 0.254: IC1.9 6.99,21.27 5.4,21.27 3.17,23.5 3.17,30.16 11.75,30.16 12.38,30.8 12.38,32.38 12.06,32.38 11.43,33.02 11.43,36.51 16.19,36.51 | 16.19,36.51 33.34,36.51 33.66,36.2 | 33.66,36.2 36.2,33.66 36.2,32.7 IC7.10 | IC8.10 55.24,35.24 v56.83,35.24 | 33.66,36.2 36.51,39.05 v55.56,39.05 v66.67,39.05 82.23,39.05 | IC9.10 74.3,34.29 78.74,34.29 82.23,37.78 82.23,39.05 | v15.24,54.29 11.43,54.29 11.43,53.02 IC3.10 | 16.19,36.51 v16.19,36.83 | v16.19,45.4 29.84,45.4 30.16,45.72 39.69,45.72 39.69,48.58 37.15,51.12 28.89,51.12 28.89,52.7 IC4.10 | v66.67,48.58 57.78,48.58 55.24,51.12 53.34,51.12 53.34,52.7 IC5.10 | v86.36,51.12 84.77,51.12 84.77,52.7 IC6.10 | v86.68,41.27 84.45,39.05 82.23,39.05
  Bottom 0.254: v56.83,35.24 55.56,36.51 v55.56,39.05 | v15.24,54.29 15.56,53.98 15.56,49.53 16.19,48.9 v16.19,45.4 v16.19,36.83 | v66.67,39.05 v66.67,48.58 | v86.36,51.12 86.68,50.8 v86.68,41.27

### Text on the board
tNames: https://github.com/545ch4/flippie | rev10 jan/2017 | flippie
bNames: https://github.com/545ch4/flippie | rev10 jan/2017 | flippie